# EAGLE design CrackberryPi_1.0.2 (EAGLE 6.5.0)
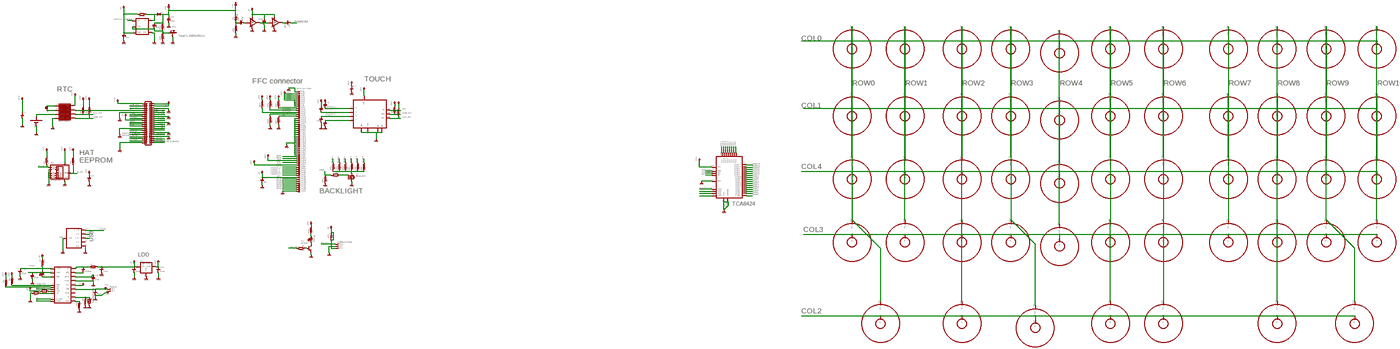
[diagram p0: schematic, sheet 1, overview]
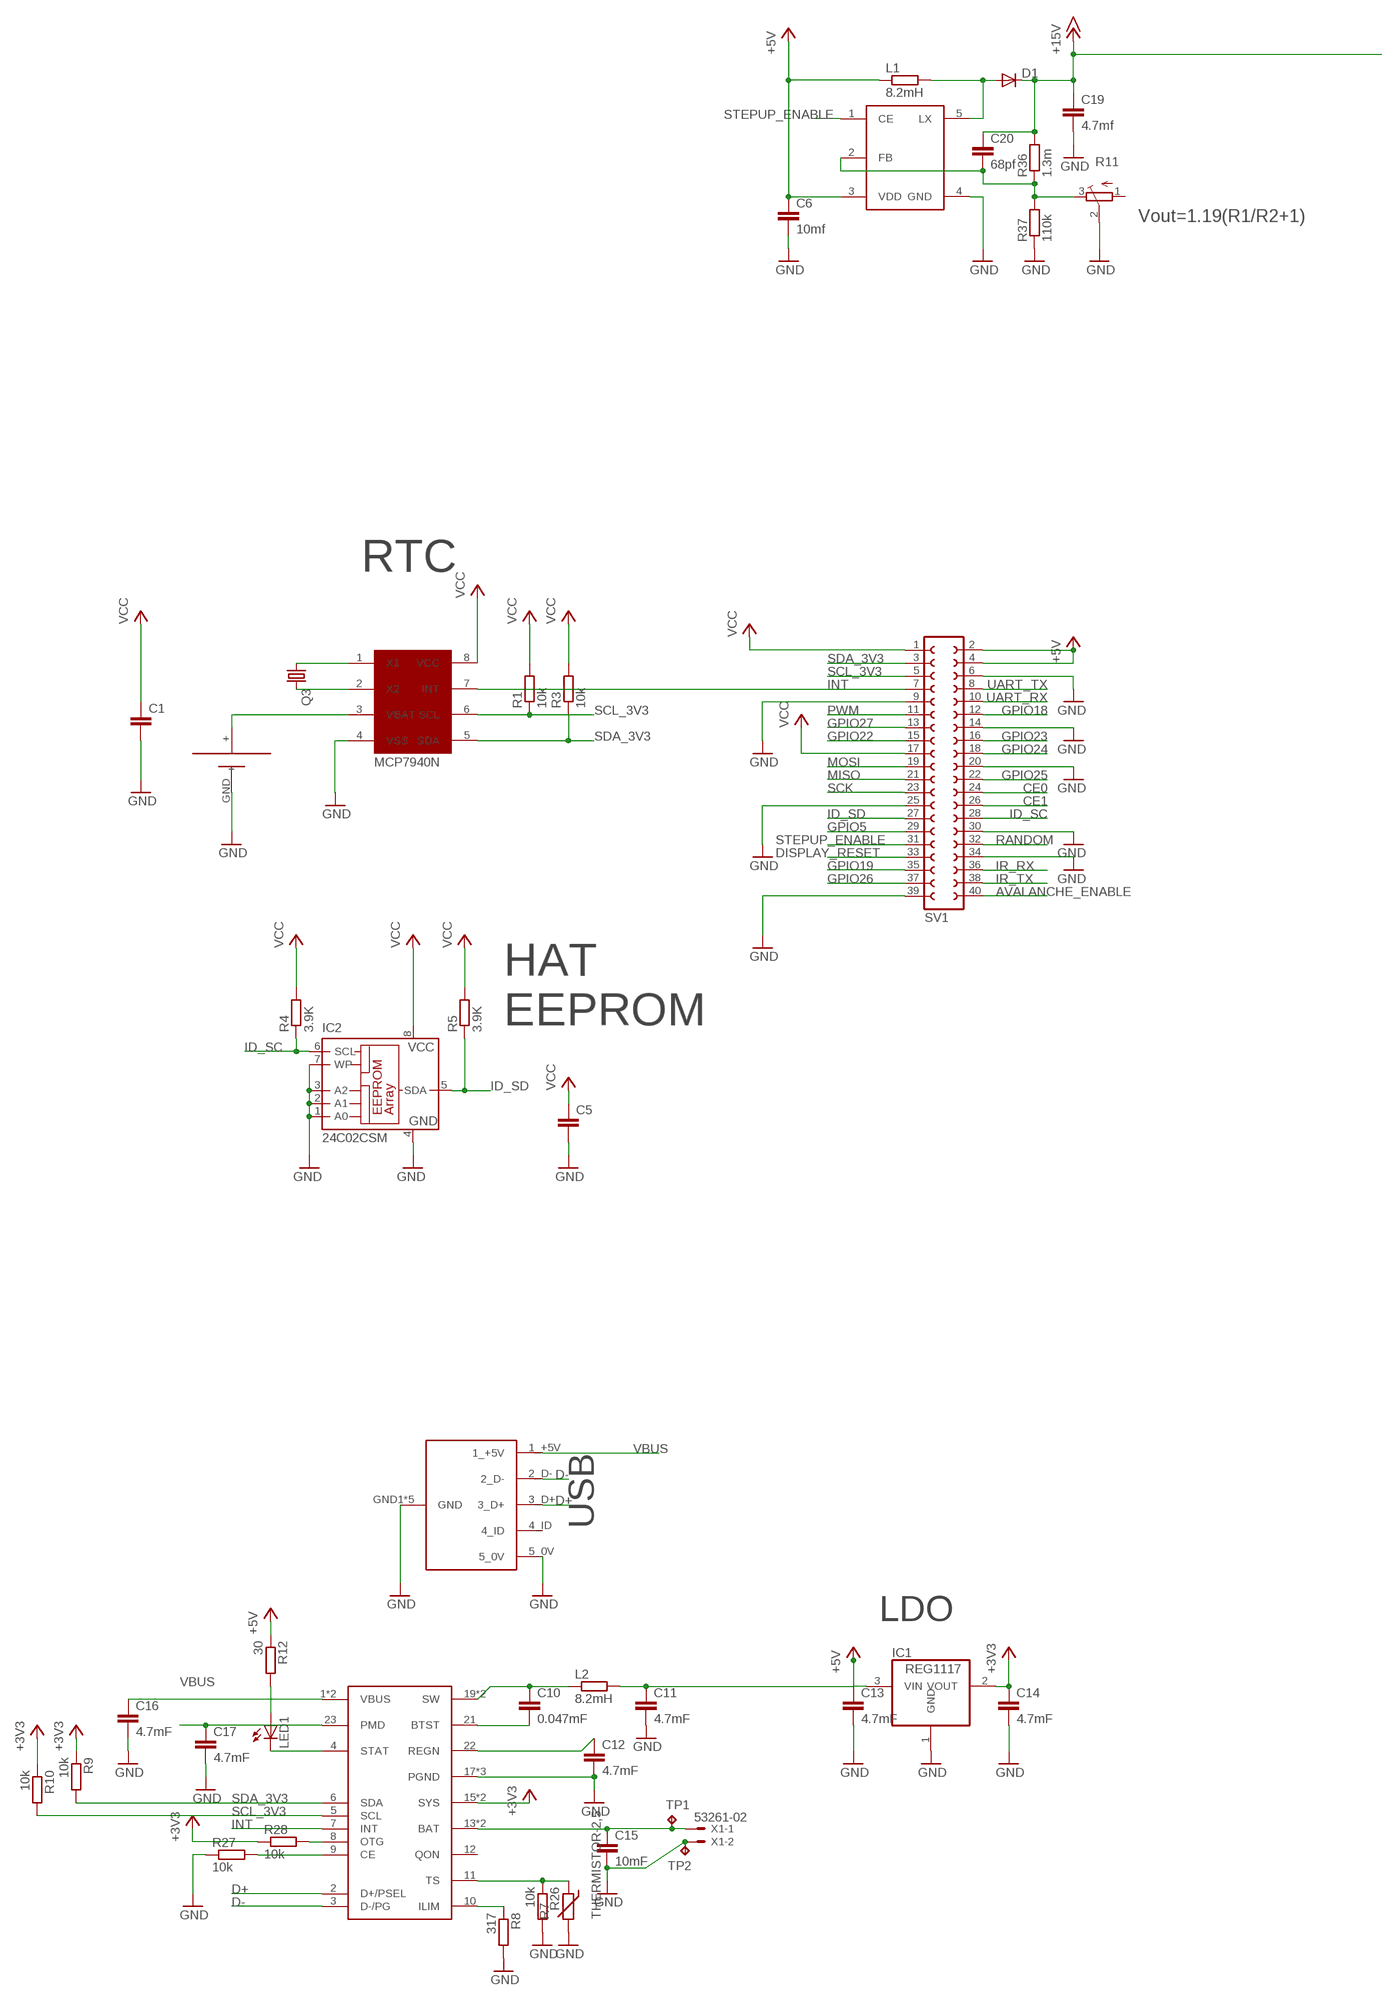
[diagram p1: schematic, sheet 1, part 1 of 4]
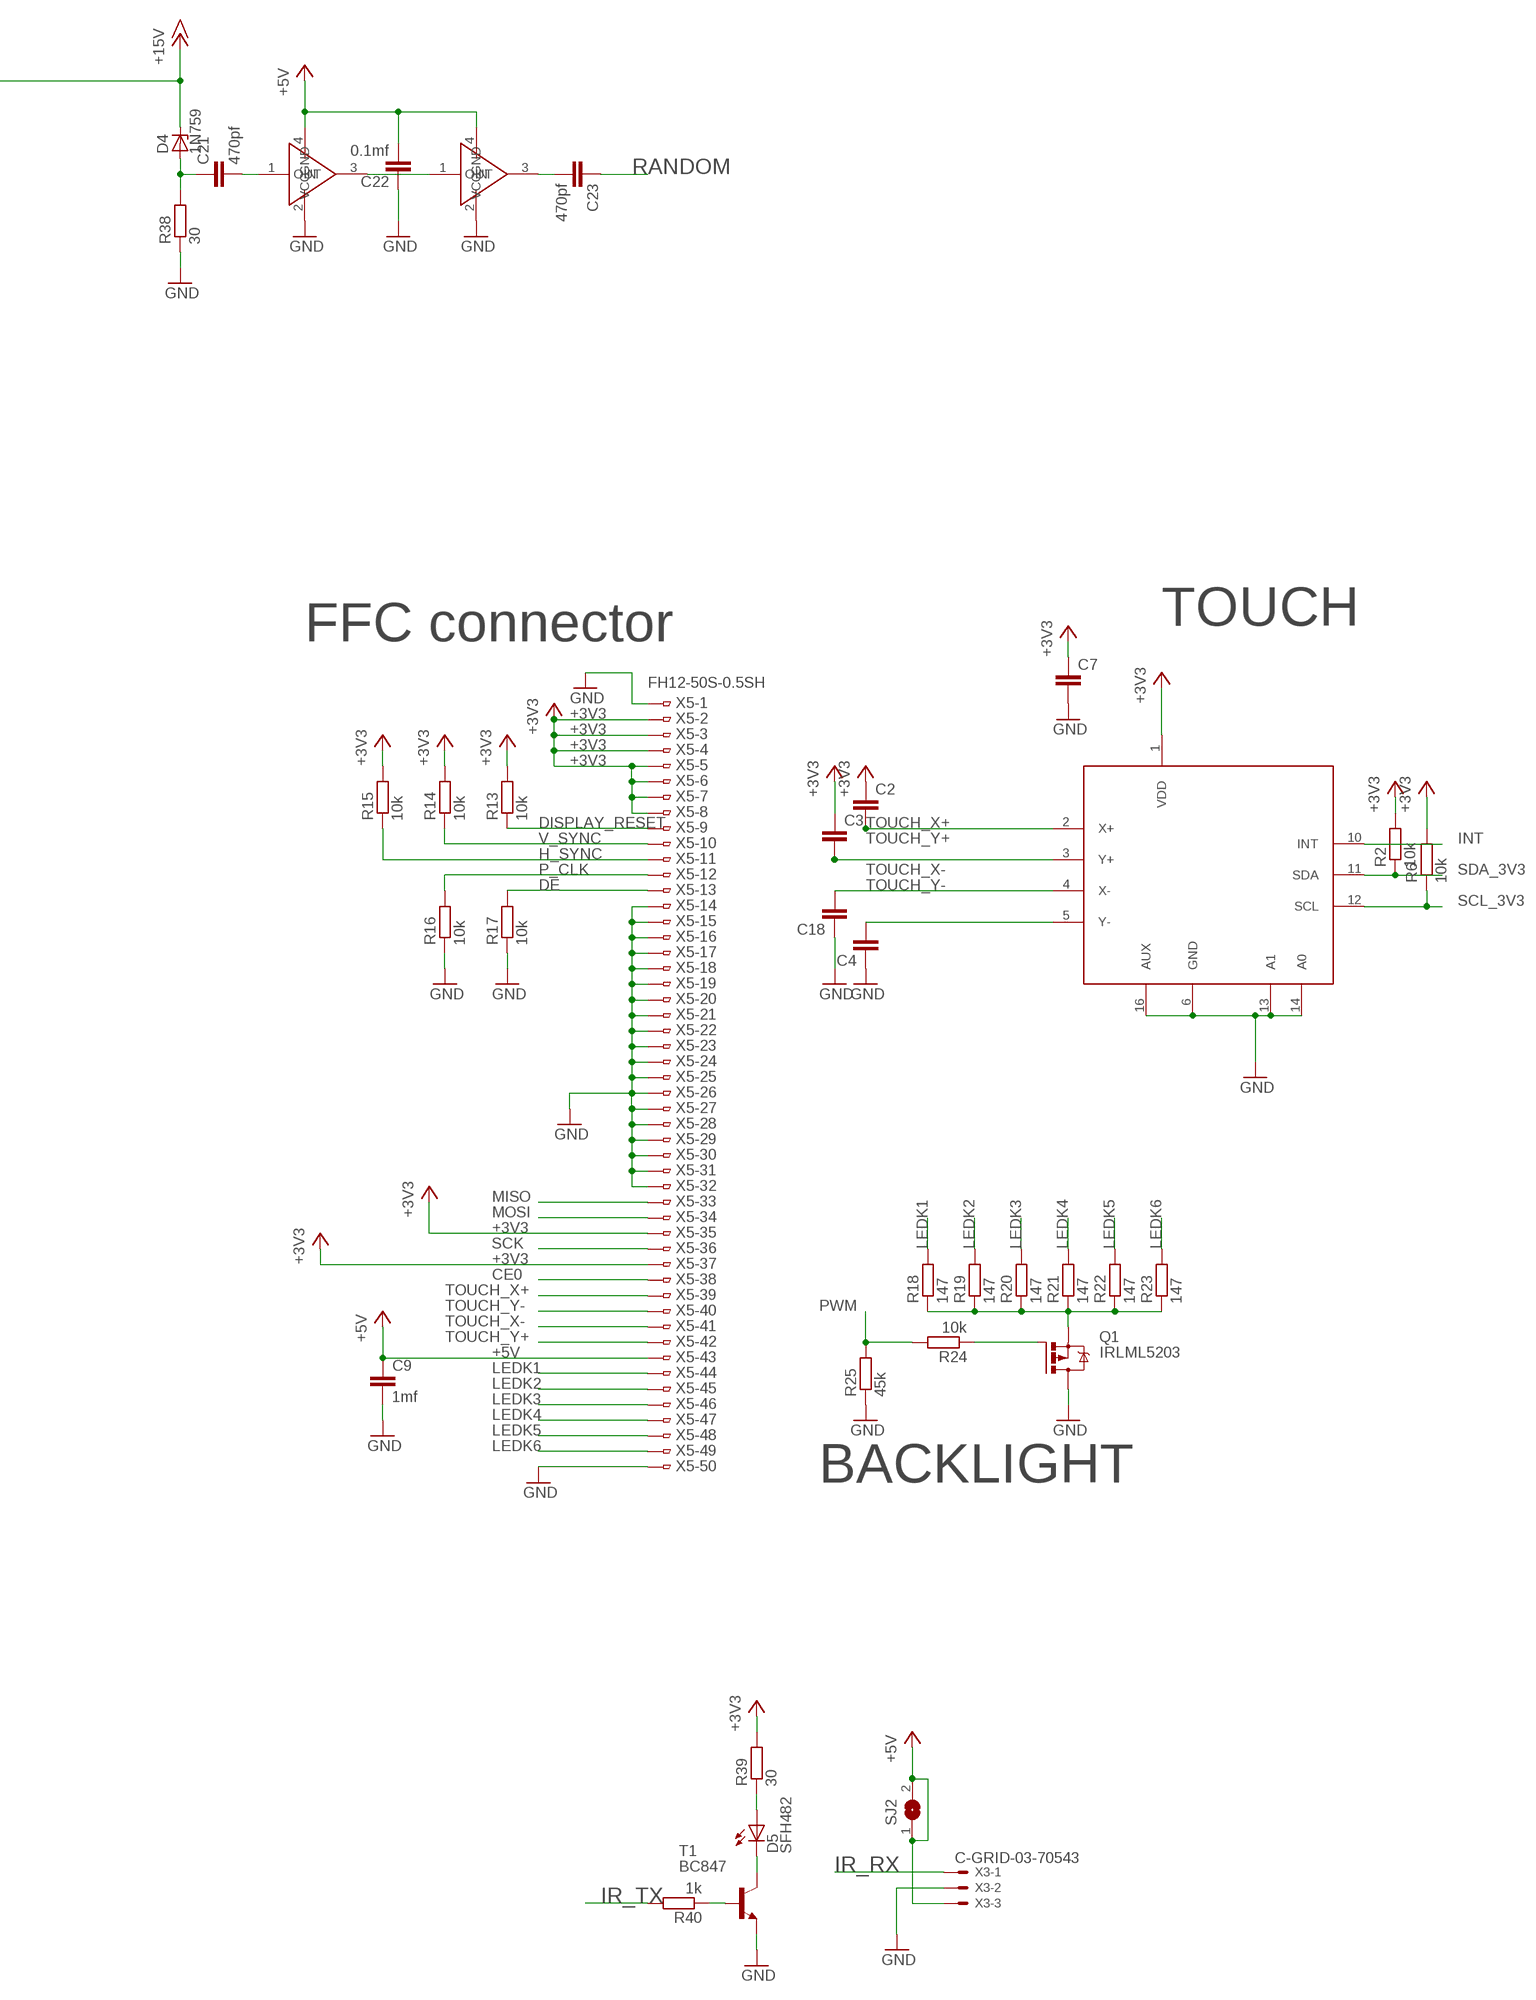
[diagram p2: schematic, sheet 1, part 2 of 4]
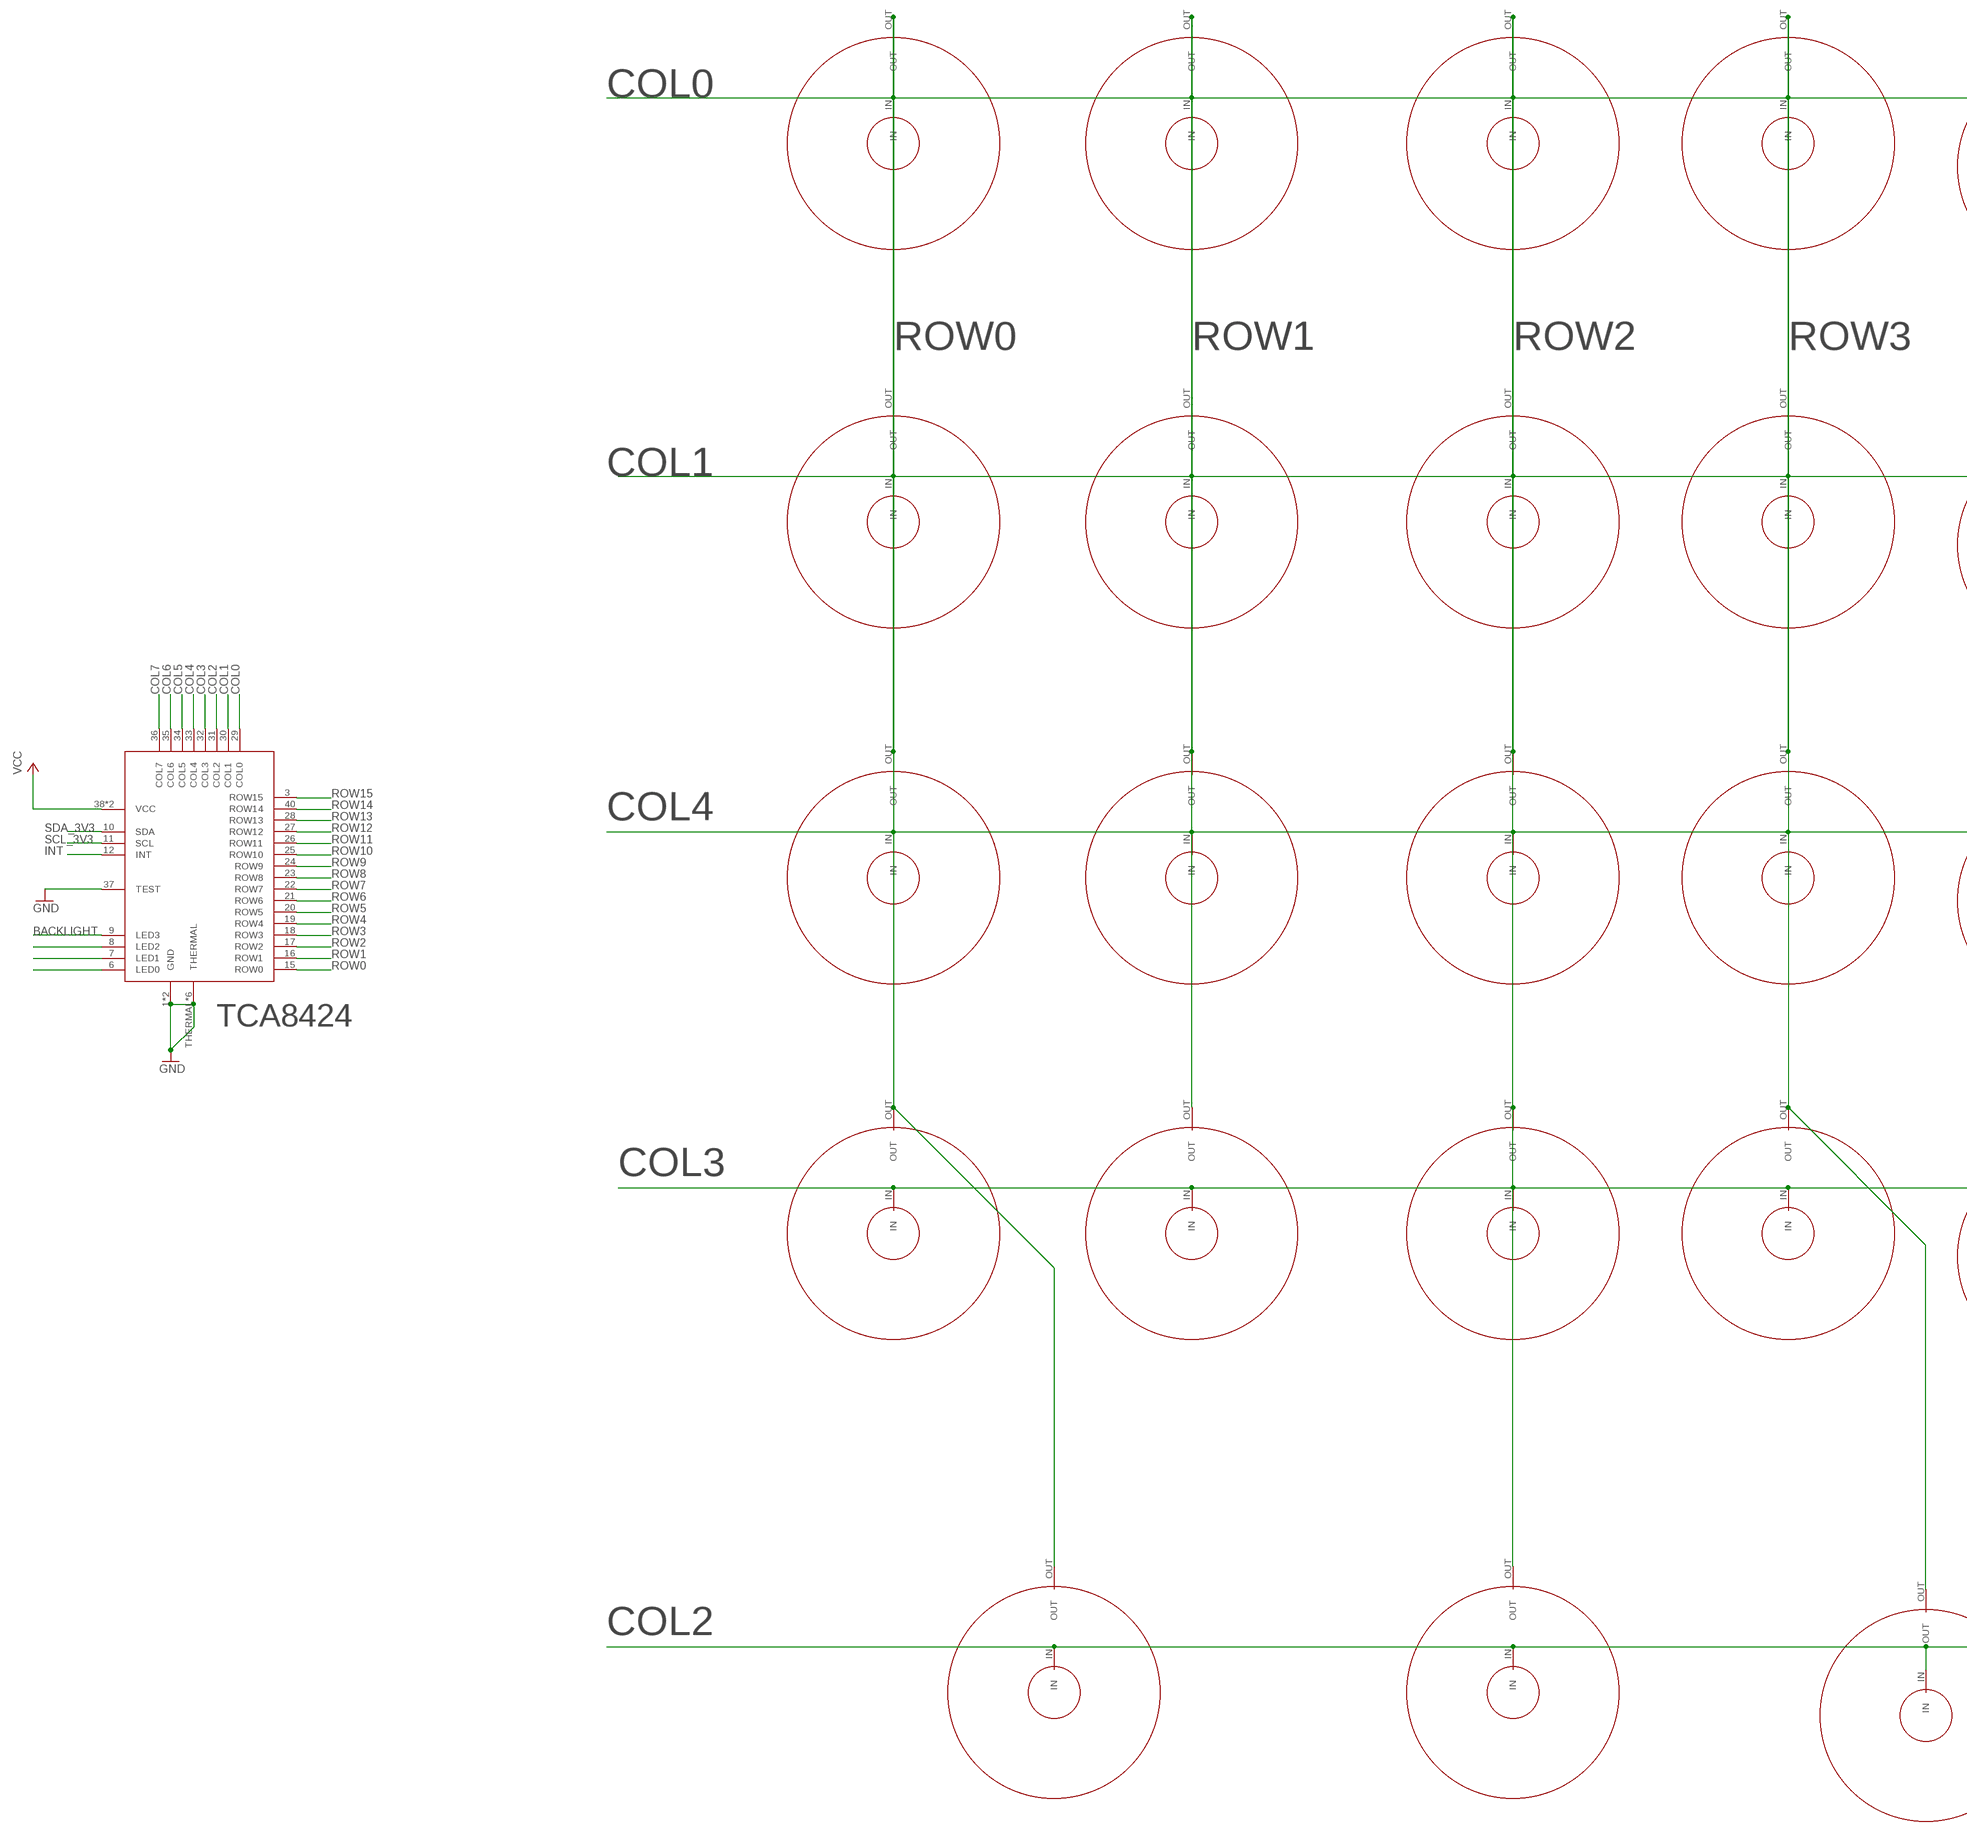
[diagram p3: schematic, sheet 1, part 3 of 4]
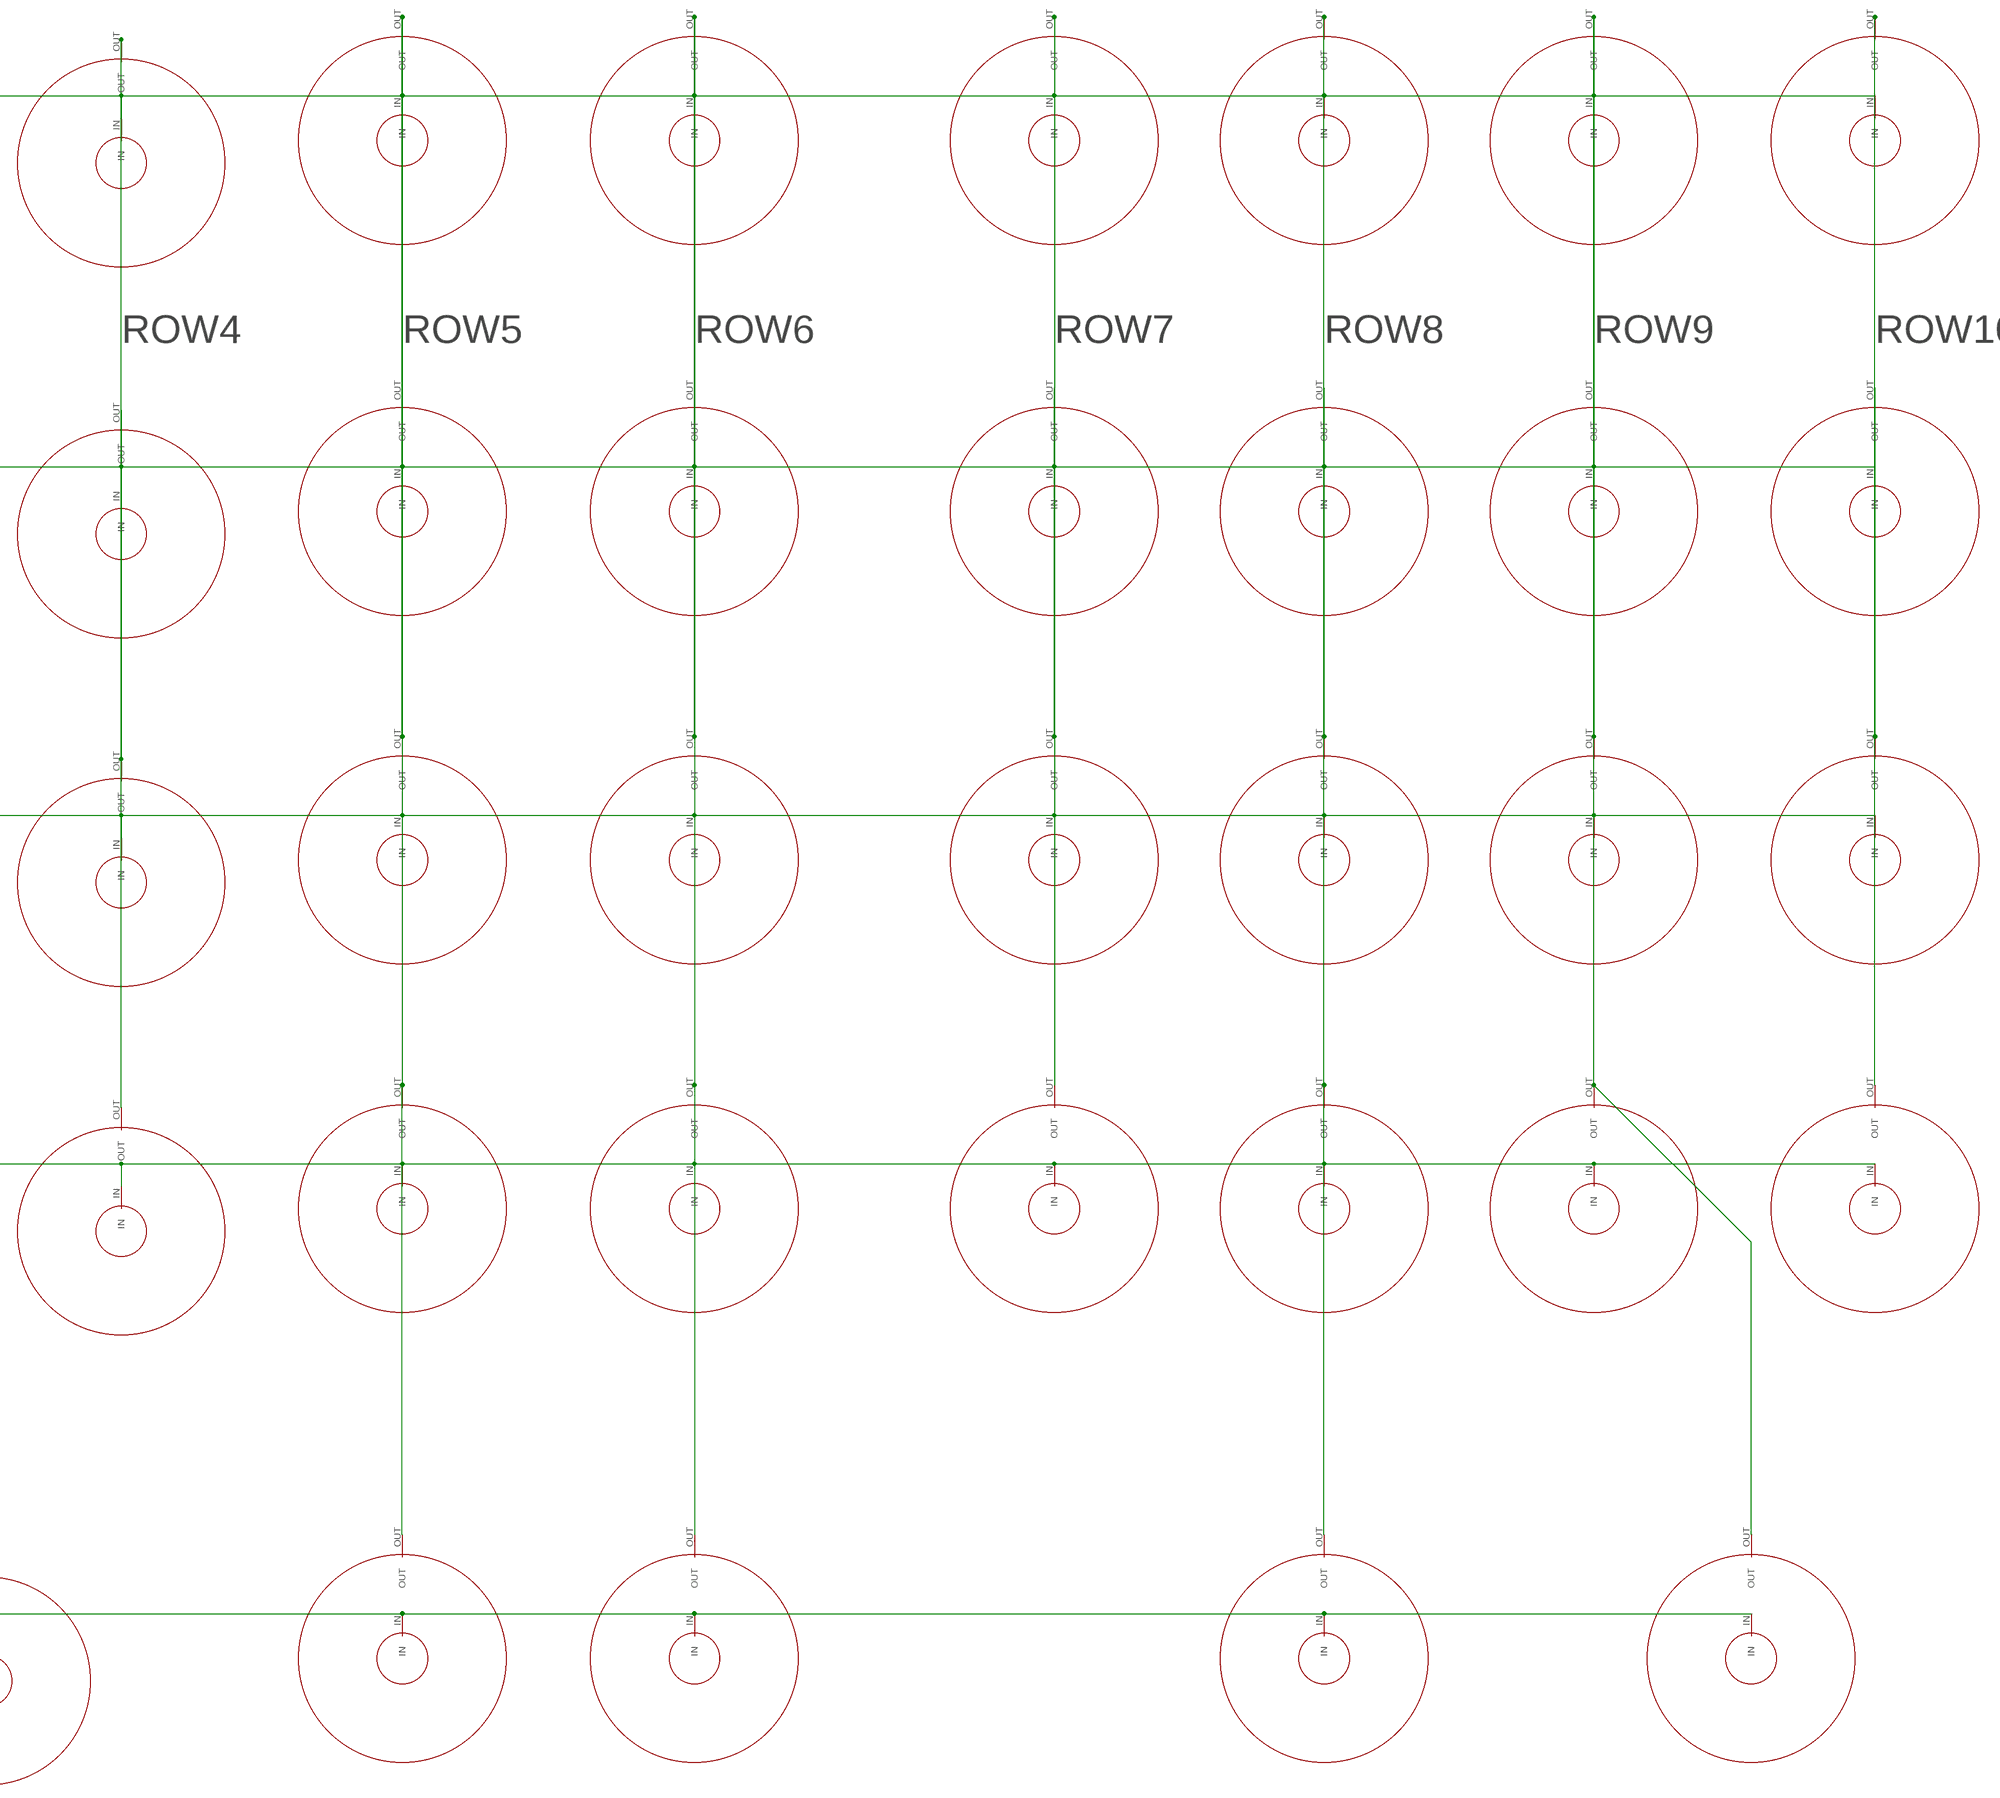
[diagram p4: schematic, sheet 1, part 4 of 4]

## Parts
0  DOME  [4MM]
1  DOME  [4MM]
2  DOME  [4MM]
3  DOME  [4MM]
4  DOME  [4MM]
5  DOME  [4MM]
6  DOME  [4MM]
7  DOME  [4MM]
8  DOME  [4MM]
9  DOME  [4MM]
!  DOME  [4MM]
(  DOME  [4MM]
)  DOME  [4MM]
+  DOME  [4MM]
,  DOME  [4MM]
-  DOME  [4MM]
.  DOME  [4MM]
?  DOME  [4MM]
@  DOME  [4MM]
A  DOME  [4MM]
B  DOME  [4MM]
C  DOME  [4MM]
C1  C-EUC0603  [C0603]
C2  C-EUC0603  [C0603]
C3  C-EUC0603  [C0603]
C4  C-EUC0603  [C0603]
C5  C-EUC0603  [C0603]
C6  10mf  C-EUC0603  [C0603]
C7  C-EUC0603  [C0603]
C9  1mf  C-EUC0603  [C0603]
C10  0.047mF  C-EUC0603  [C0603]
C11  4.7mF  C-EUC0603  [C0603]
C12  4.7mF  C-EUC0603  [C0603]
C13  4.7mF  C-EUC0603  [C0603]
C14  4.7mF  C-EUC0603  [C0603]
C15  10mF  C-EUC0603  [C0603]
C16  4.7mF  C-EUC0603  [C0603]
C17  4.7mF  C-EUC0603  [C0603]
C18  C-EUC0603  [C0603]
C19  4.7mf  C-EUC0603  [C0603]
C20  68pf  C-EUC0603  [C0603]
C21  470pf  C-EUC0603  [C0603]
C22  0.1mf  C-EUC0603  [C0603]
C23  470pf  C-EUC0603  [C0603]
D  DOME  [4MM]
D1  DIODE-SOD123  [SOD123]
D4  1N759  ZENER-DIODESOD80C  [SOD80C]
D5  SFH482  [SFH482]
E  DOME  [4MM]
F  DOME  [4MM]
FN-RIGHT  DOME  [4MM]
G  DOME  [4MM]
H  DOME  [4MM]
I  DOME  [4MM]
IC1  REG1117  [SOT223]
IC2  24C02CSM  [SO-08M]
J  DOME  [4MM]
K  DOME  [4MM]
L  DOME  [4MM]
L1  8.2mH  R-EU_R1206W  [R1206W]
L2  8.2mH  R-EU_R1206W  [R1206W]
LED1  LEDSML0603  [SML0603]
M  DOME  [4MM]
N  DOME  [4MM]
O  DOME  [4MM]
P  DOME  [4MM]
Q  DOME  [4MM]
Q1  IRLML5203  [MICRO3]
Q3  CRYSTALMM20SS  [MM20SS]
R  DOME  [4MM]
R1  10k  R-EU_R0603  [R0603]
R2  10k  R-EU_R0603  [R0603]
R3  10k  R-EU_R0603  [R0603]
R4  3.9K  R-EU_R0603  [R0603]
R5  3.9K  R-EU_R0603  [R0603]
R6  10k  R-EU_R0603  [R0603]
R7  THERMISTOR-2,5  [RS-2,5]
R8  317  R-EU_R0603  [R0603]
R9  10k  R-EU_R0603  [R0603]
R10  10k  R-EU_R0603  [R0603]
R11  TRIM_EU-3223G  [3223G]
R12  30  R-EU_R0603  [R0603]
R13  10k  R-EU_R0603  [R0603]
R14  10k  R-EU_R0603  [R0603]
R15  10k  R-EU_R0603  [R0603]
R16  10k  R-EU_R0603  [R0603]
R17  10k  R-EU_R0603  [R0603]
R18  147  R-EU_R0603  [R0603]
R19  147  R-EU_R0603  [R0603]
R20  147  R-EU_R0603  [R0603]
R21  147  R-EU_R0603  [R0603]
R22  147  R-EU_R0603  [R0603]
R23  147  R-EU_R0603  [R0603]
R24  10k  R-EU_R0603  [R0603]
R25  45k  R-EU_R0603  [R0603]
R26  10k  R-EU_R0603  [R0603]
R27  10k  R-EU_R0603  [R0603]
R28  10k  R-EU_R0603  [R0603]
R36  1.3m  R-EU_R0603  [R0603]
R37  110k  R-EU_R0603  [R0603]
R38  30  R-EU_R0603  [R0603]
R39  30  R-EU_R0603  [R0603]
R40  1k  R-EU_R0603  [R0603]
S  DOME  [4MM]
SHIFT-RIGHT  DOME  [4MM]
SHILFT-LEFT  DOME  [4MM]
SJ2  SJ  [SJ]
SPACE1  DOME  [4MM]
SPACE2  DOME  [4MM]
SPACE3  DOME  [4MM]
SV1  FE20-2  [FE20-2]
T  DOME  [4MM]
T1  BC847  [SOT23]
TP1  TPTP20SQ  [TP20SQ]
TP2  TPTP20SQ  [TP20SQ]
U  DOME  [4MM]
U$1  BQ24297  [VQFN-4X4-24]
U$2  NCP1406  [SOT23-5L]
U$3  MAX2650  [SOT143-W]
U$4  CR1216  [CR1216]
U$5  MCP7940N  [SO08]
U$6  TSC2007  [TSSOP16]
U$7  TCA8424  [QFN40]
U$9  MICRO_USB  [MICRO_USB]
U$10  MAX2650  [SOT143-W]
V  DOME  [4MM]
W  DOME  [4MM]
X  DOME  [4MM]
X1  53261-02  [53261-02]
X3  C-GRID-03-70543  [70543-03]
X5  FH12-50S-0.5SH  [FH12-50S-0.5SH]
Y  DOME  [4MM]
Z  DOME  [4MM]

## Nets
+3V3: C2.1 C3.1 C7.1 C14.1 IC1.2(VOUT) R2.2 R6.2 R9.1 R10.1 R13.2 R14.2 R15.2 R28.1 R39.2 U$1.15(SYS) U$1.16(SYS) U$6.1(VDD) X5.2 X5.3 X5.4 X5.5 X5.6 X5.7 X5.8 X5.35 X5.37
+5V: C6.1 C9.1 C11.1 C13.1 C22.2 IC1.3(VIN) L1.1 L2.2 R12.1 SJ2.1 SJ2.2 SV1.2 SV1.4 U$2.3(VDD) U$3.4(VCC) U$10.4(VCC) X3.3 X5.43
+15V: C19.1 C20.1 D1.C D4.C R36.2
AVALANCHE_ENABLE: SV1.40
BACKLIGHT: U$7.9(LED3)
BASE: R40.1 T1.1(B)
CE0: SV1.24 X5.38
CE1: SV1.26
COL0: 0.IN 1.IN 2.IN 3.IN 4.IN 5.IN 6.IN 7.IN 8.IN 9.IN -.IN U$7.29(COL0)
COL1: +.IN E.IN I.IN O.IN P.IN Q.IN R.IN T.IN U$7.30(COL1) U.IN W.IN Y.IN
COL2: @.IN FN-RIGHT.IN SHIFT-RIGHT.IN SHILFT-LEFT.IN SPACE1.IN SPACE2.IN SPACE3.IN U$7.31(COL2)
COL3: !.IN ,.IN ..IN ?.IN B.IN C.IN M.IN N.IN U$7.32(COL3) V.IN X.IN Z.IN
COL4: (.IN ).IN A.IN D.IN F.IN G.IN H.IN J.IN K.IN L.IN S.IN U$7.33(COL4)
COL5: U$7.34(COL5)
COL6: U$7.35(COL6)
COL7: U$7.36(COL7)
COLLECTOR: D5.K(C) T1.3(C)
D+: U$1.2(D+/PSEL) U$9.3_D+
D-: U$1.3(D-/PG) U$9.2_D-
DE: R17.2 X5.13
DISPLAY_RESET: R13.1 SV1.33 X5.9
EMITTER: T1.2(E) ; supply symbol labelled GND
FB: C20.2 R11.3(E) R36.1 R37.2 U$2.2(FB)
GND: C1.2 C4.1 C5.2 C6.2 C7.2 C9.2 C11.2 C12.2 C13.2 C14.2 C15.2 C16.2 C17.2 C18.1 C19.2 C22.1 IC1.1(GND) IC2.1(A0) IC2.2(A1) IC2.3(A2) IC2.4(GND) IC2.7(WP) Q1.3(D) R7.2 R8.2 R11.2(S) R16.1 R17.1 R25.1 R26.2 R27.1 R37.1 R38.1 SV1.6 SV1.9 SV1.14 SV1.20 SV1.25 SV1.30 SV1.34 SV1.39 TP2.TP U$1.17(PGND) U$1.18(PGND) U$1.P$1(PGND) U$2.4(GND) U$3.2(GND) U$4.GND(-) U$5.4(VSS) U$6.6(GND) U$6.13(A1) U$6.14(A0) U$6.16(AUX) U$7.1(GND) U$7.4(GND) U$7.37(TEST) U$7.THERMAL U$7.VIA1(THERMAL) U$7.VIA2(THERMAL) U$7.VIA3(THERMAL) U$7.VIA4(THERMAL) U$7.VIA5(THERMAL) U$9.5_0V U$9.GND1(GND) U$9.GND2(GND) U$9.GND5(GND) U$9.P$1(GND) U$9.P$7(GND) U$10.2(GND) X1.2 X3.2 X5.1 X5.14 X5.15 X5.16 X5.17 X5.18 X5.19 X5.20 X5.21 X5.22 X5.23 X5.24 X5.25 X5.26 X5.27 X5.28 X5.29 X5.30 X5.31 X5.32 X5.50
GPIO5: SV1.29
GPIO18: SV1.12
GPIO19: SV1.35
GPIO22: SV1.15
GPIO23: SV1.16
GPIO24: SV1.18
GPIO25: SV1.22
GPIO26: SV1.37
GPIO27: SV1.13
H_SYNC: R15.1 X5.11
ID_SC: IC2.6(SCL) R4.1 SV1.28
ID_SD: IC2.5(SDA) R5.1 SV1.27
IN_1: C21.2 U$3.1(IN)
INT: SV1.7 U$1.7(INT) U$5.7(INT) U$6.10(INT) U$7.12(INT)
IR_RX: SV1.36 X3.1
IR_TX: R40.2 SV1.38
LEDK1: R18.2 X5.44
LEDK2: R19.2 X5.45
LEDK3: R20.2 X5.46
LEDK4: R21.2 X5.47
LEDK5: R22.2 X5.48
LEDK6: R23.2 X5.49
LX: D1.A L1.2 U$2.5(LX)
MISO: SV1.21 X5.33
MOSI: SV1.19 X5.34
N$1: C10.1 L2.1 U$1.19(SW) U$1.20(SW)
N$2: C10.2 U$1.21(BTST)
N$3: C15.1 TP1.TP U$1.13(BAT) U$1.14(BAT) X1.1
N$4: LED1.A R12.2
N$5: C12.1 U$1.22(REGN)
N$6: R7.1 R26.1 U$1.11(TS)
N$7: R8.1 U$1.10(ILIM)
N$8: C17.1 U$1.23(PMD)
N$9: LED1.C U$1.4(STAT)
N$10: U$7.6(LED0)
N$11: Q3.1 U$5.1(X1)
N$12: Q1.2(S) R18.1 R19.1 R20.1 R21.1 R22.1 R23.1
N$13: Q3.4 U$5.2(X2)
N$14: U$7.7(LED1)
N$15: R27.2 U$1.9(CE)
N$16: C21.1 D4.A R38.2
N$17: R28.2 U$1.8(OTG)
N$18: U$7.8(LED2)
N$20: Q1.1(G) R24.1
N$30: D5.A R39.1
OUT1_IN2: U$3.3(OUT) U$10.1(IN)
OUT2: C23.2 U$10.3(OUT)
P_CLK: R16.2 X5.12
PWM: R24.2 R25.2 SV1.11
RANDOM: C23.1 SV1.32
ROW0: 1.OUT A.OUT Q.OUT SHILFT-LEFT.OUT U$7.15(ROW0) Z.OUT
ROW1: 2.OUT S.OUT U$7.16(ROW1) W.OUT X.OUT
ROW2: 3.OUT C.OUT D.OUT E.OUT SPACE1.OUT U$7.17(ROW2)
ROW3: 4.OUT F.OUT R.OUT SPACE2.OUT U$7.18(ROW3) V.OUT
ROW4: 5.OUT B.OUT G.OUT T.OUT U$7.19(ROW4)
ROW5: 6.OUT H.OUT N.OUT SPACE3.OUT U$7.20(ROW5) Y.OUT
ROW6: 7.OUT J.OUT M.OUT SHIFT-RIGHT.OUT U$7.21(ROW6) U.OUT
ROW7: 8.OUT ?.OUT I.OUT K.OUT U$7.22(ROW7)
ROW8: 9.OUT !.OUT @.OUT L.OUT O.OUT U$7.23(ROW8)
ROW9: 0.OUT (.OUT ,.OUT FN-RIGHT.OUT P.OUT U$7.24(ROW9)
ROW10: ).OUT +.OUT -.OUT ..OUT U$7.25(ROW10)
ROW11: U$7.26(ROW11)
ROW12: U$7.27(ROW12)
ROW13: U$7.28(ROW13)
ROW14: U$7.40(ROW14)
ROW15: U$7.3(ROW15)
SCK: SV1.23 X5.36
SCL_3V3: R1.1 R6.1 R10.2 SV1.5 U$1.5(SCL) U$5.6(SCL) U$6.12(SCL) U$7.11(SCL)
SDA_3V3: R2.1 R3.1 R9.2 SV1.3 U$1.6(SDA) U$5.5(SDA) U$6.11(SDA) U$7.10(SDA)
STEPUP_ENABLE: SV1.31 U$2.1(CE)
TOUCH_X+: C2.2 U$6.2(X+) X5.39
TOUCH_X-: C18.2 U$6.4(X-) X5.41
TOUCH_Y+: C3.2 U$6.3(Y+) X5.42
TOUCH_Y-: C4.2 U$6.5(Y-) X5.40
UART_RX: SV1.10
UART_TX: SV1.8
V_SYNC: R14.1 X5.10
VBAT+: U$4.+ U$5.3(VBAT)
VBUS: C16.1 U$1.1(VBUS) U$1.24(VBUS) U$9.1_+5V
VCC: C1.1 C5.1 IC2.8(VCC) R1.2 R3.2 R4.2 R5.2 SV1.1 SV1.17 U$5.8(VCC) U$7.38(VCC) U$7.39(VCC)
Unconnected: R11.1(A) U$1.12(QON) U$9.4_ID

## Notes on the sheet
- Vout=1.19(R1/R2+1)
- FFC connector | TOUCH
- RTC
- MCP7940N
- HAT
  EEPROM
- BACKLIGHT
- TCA8424
- USB
- LDO

## Library data of the parts
0 1-9 ! ( ) + , - . ? @ A B C D E F FN-RIGHT G H I J K L M N O P Q R S SHIFT-RIGHT SHILFT-LEFT SPACE1-SPACE3 T U V W X Y Z = DOME:DOME
C1-C7 C9-C23 = rcl:C-EU: CAPACITOR, European symbol
D1 = diode:DIODE-: DIODE
D4 = diode:ZENER-DIODE: Z-Diode
D5 = led:SFH482: IR LED infrared emitting diode, Infineon
IC1 = burr-brown:REG1117: 800mA and 1A Low Dropout (LDO) Positive Regulator 1.8V, 2.5V, 2.85V, 3.3V, 5V, and Adj; MPN: REG1117; OC_FARNELL: 1097566; OC_NEWARK: 14P6981
IC2 = microchip:24C*: Serial EEPROM 1 K/2 K/4 K; MF: MICROCHIP; MPN: 24C02C-I/SN; OC_FARNELL: 1084339; OC_NEWARK: 96K4063
L1 L2 R1-R6 R8-R10 R12-R28 R36-R40 = rcl:R-EU_: RESISTOR, European symbol
LED1 = led:LED: LED OSRAM: - CHIPLED LG R971, LG N971, LY N971, LG Q971, LY Q971, LO R971, LY R971 LH N974, LH R974 LS Q976, LO Q976, LY Q976 LO Q996 - Hyper CHIPLED LW Q18S LB Q993, LB Q99A, LB R99A - SideLED LS A670, LO A670, LY A670, LG A670, LP A670 LB A673, LV A673, LT A673, LW A673 LH A674 LY A675 LS A676, LA A676, LO A676, LY A676, LW A676 LS A679, LY A679, LG A679 - Hyper Micro SIDELED® LS Y876, LA Y876, LO Y876, LY Y876 LT Y87S - SmartLED LW L88C, LW L88S LB L89C, LB L89S, LG L890 LS L89K, LO L89K, LY L89K LS L896, LA L896, LO L896, LY L896 - TOPLED LS T670, LO T670, LY T670, LG T670, LP T670 LSG T670, LSP T670, LSY T670, LOP T670, LYG T670 LG T671, LOG T671, LSG T671 LB T673, LV T673, LT T673, LW T673 LH T674 LS T676, LA T676, LO T676, LY T676, LB T676, LH T676, LSB T676, LW T676 LB T67C, LV T67C, LT T67C, LS T67K, LO T67K, LY T67K, LW E67C LS E67B, LA E67B, LO E67B, LY E67B, LB E67C, LV E67C, LT E67C LW T67C LS T679, LY T679, LG T679 LS T770, LO T770, LY T770, LG T770, LP T770 LB T773, LV T773, LT T773, LW T773 LH T774 LS E675, LA E675, LY E675, LS T675 LS T776, LA T776, LO T776, LY T776, LB T776 LHGB T686 LT T68C, LB T68C - Hyper Mini TOPLED® LB M676 - Mini TOPLED Santana® LG M470 LS M47K, LO M47K, LY M47K Source: http://www.osram.convergy.de LUXEON: - LUMILED® LXK2-PW12-R00, LXK2-PW12-S00, LXK2-PW14-U00, LXK2-PW14-V00 LXK2-PM12-R00, LXK2-PM12-S00, LXK2-PM14-U00 LXK2-PE12-Q00, LXK2-PE12-R00, LXK2-PE12-S00, LXK2-PE14-T00, LXK2-PE14-U00 LXK2-PB12-K00, LXK2-PB12-L00, LXK2-PB12-M00, LXK2-PB14-N00, LXK2-PB14-P00, LXK2-PB14-Q00 LXK2-PR12-L00, LXK2-PR12-M00, LXK2-PR14-Q00, LXK2-PR14-R00 LXK2-PD12-Q00, LXK2-PD12-R00, LXK2-PD12-S00 LXK2-PH12-R00, LXK2-PH12-S00 LXK2-PL12-P00, LXK2-PL12-Q00, LXK2-PL12-R00 Source: www.luxeon.com KINGBRIGHT: KA-3528ASYC Source: www.kingbright.com
Q1 = transistor-power:IRLML5203: HEXFET P-Channel Power MOSFET
Q3 = crystal:CRYSTAL: CRYSTAL; OC_FARNELL: unknown; OC_NEWARK: unknown
R7 = varistor:THERMISTOR: THERMISTOR
R11 = pot:TRIM_EU-: POTENTIOMETER
SJ2 = jumper:SJ: SMD solder JUMPER
SV1 = con-lsta:FE20-2: FEMALE HEADER; OC_FARNELL: unknown; OC_NEWARK: unknown
T1 = transistor:BC847: NPN TRANSISTOR
TP1 TP2 = testpad:TP: Test pad
U$1 = BQ24297:BQ24297
U$2 = ncp1406:NCP1406
U$3 U$10 = max2650:MAX2650
U$4 = cr1216:CR1216
U$5 = MCP7940N:MCP7940N
U$6 = tsc2046:TSC2007
U$7 = TCA8424:TCA8424
U$9 = MICRO_USB:MICRO_USB
X1 = con-molex:53?-02: CONNECTOR wire to board 1.25 mm (.049 inch) pitch header; OC_FARNELL: 1125373; OC_NEWARK: unknown
X3 = con-molex:C-GRID-03: CONNECTOR wire to board 2.54 mm (0.100") pitch header; OC_FARNELL: unknown; OC_NEWARK: unknown
X5 = FCI_62684:FH12-50S-0.5S: 0.5mm Pitch Connectors For FPC/FFC Source: Data sheet <http://www.hirose.co.jp/cataloge_hp/e58605370.pdf>; MPN: FH12-50S-0.5SH(55); OC_FARNELL: 1324557; OC_NEWARK: 34M6181

## Board
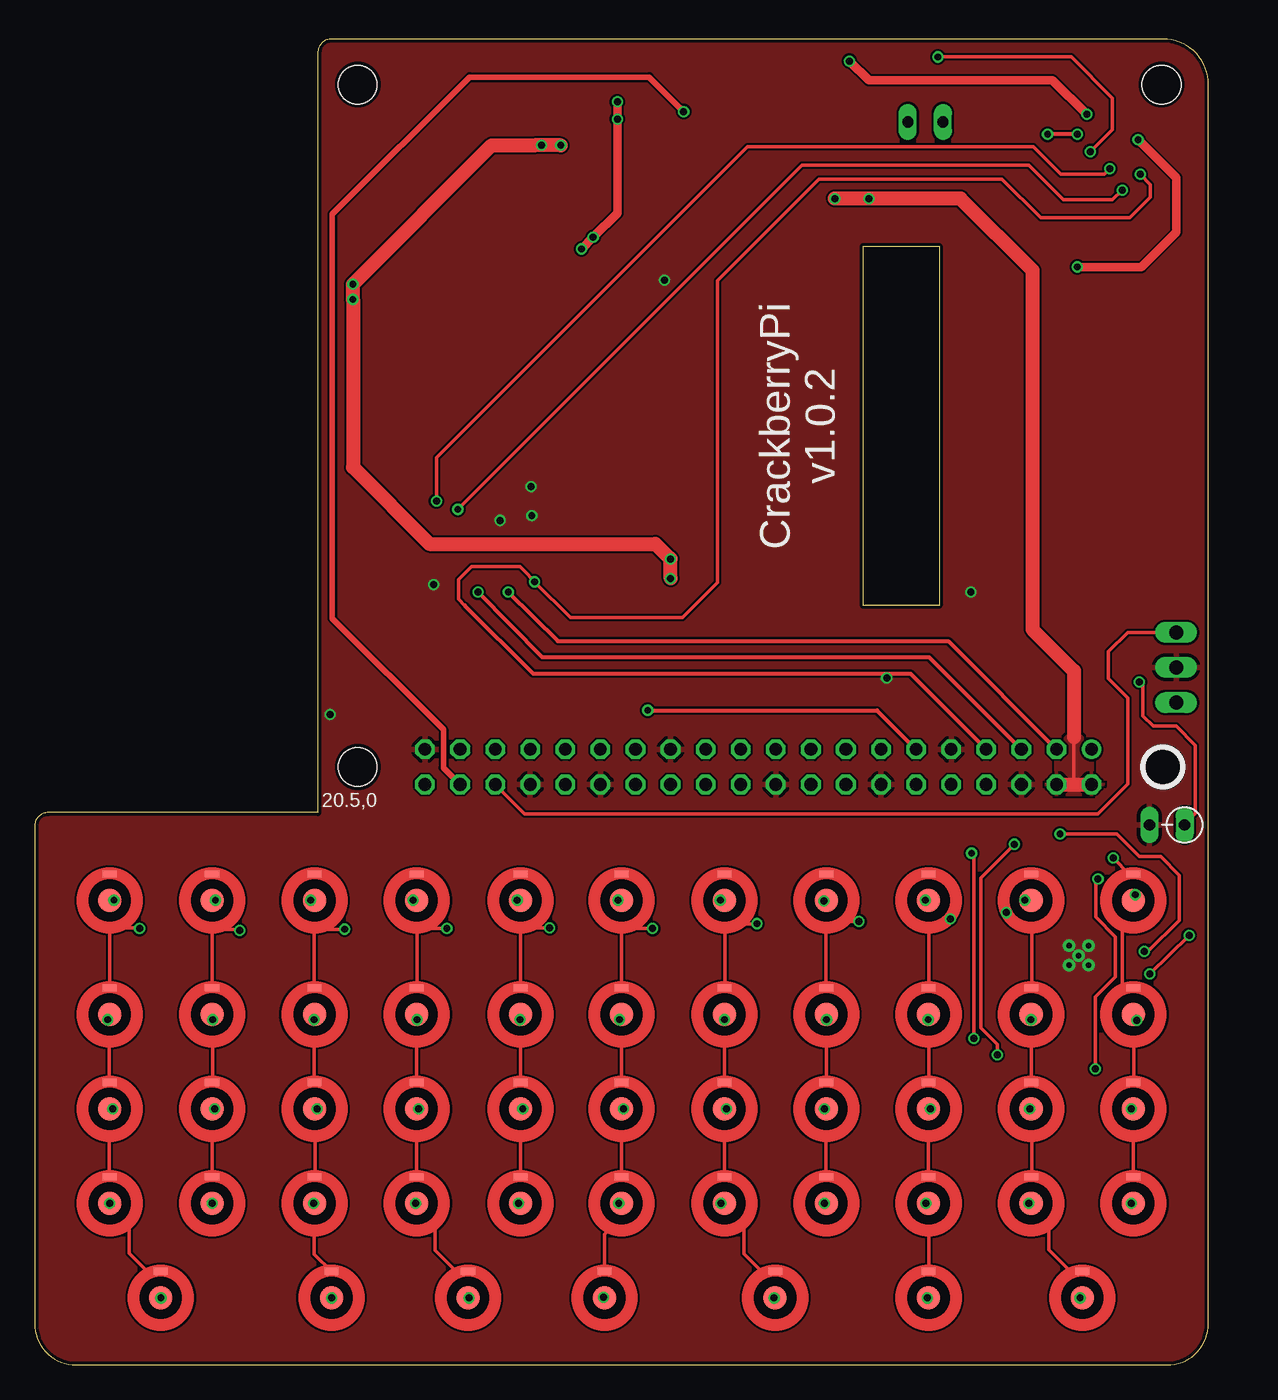
[diagram p5: board, top side]
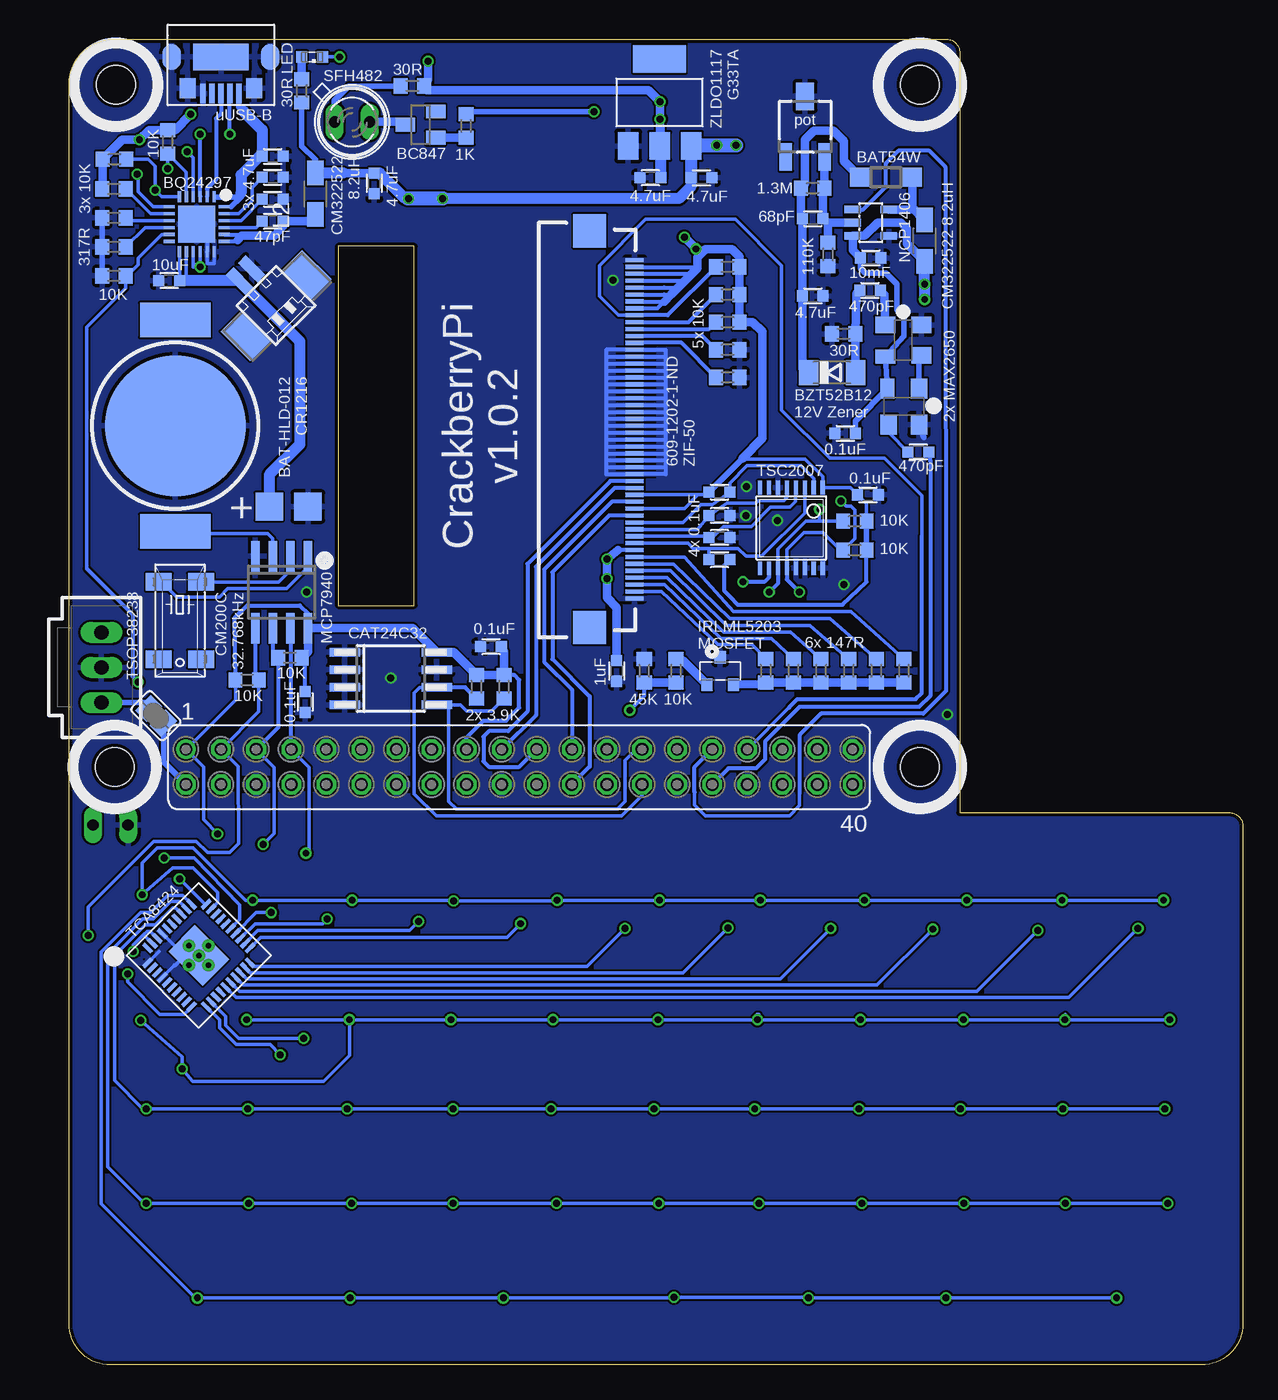
[diagram p6: board, bottom side, seen from below]

Size 85 x 96 mm. Coordinates in mm from the lower left corner, seen from the top.
Outline: 0,39 0,3 arc90 3,0 82,0 arc90 85,3 85,92.7 arc90 81.7,96 21.5,96 arc90 20.5,95 20.5,40 1,40 arc90 0,39
Outline: 65.5,55 60,55 60,81 65.5,81 65.5,55
Copper layers (1*16): Top 0.035mm / dielectric 1.5mm / Bottom 0.035mm
Design rules "SeeedStudio_2layer_DRU_no_angle_20140221": minimum track width 6mil, minimum drill 12mil, track to track 6mil, track to pad 6mil, pad to pad 6mil, via to via 6mil, smd to smd 0mil, copper to edge 10mil, drill to drill 10mil, minimum pad ring 10mil, minimum via ring 6mil, stop-mask expansion 2mil, vias tented up to drill 100mil, thermal gap 10mil
Holes 2.8 mm at 81.7,43.3 81.6,92.7 23.4,92.7 23.4,43.3
bKeepout: area 31.9,57 to 32.1,58.2
bRestrict: area 42.5,73.2 to 45.4,73.3; area 42.5,72.7 to 45.4,72.8; area 42.5,72.2 to 45.4,72.3; area 42.5,71.7 to 45.4,71.8; area 42.5,71.2 to 45.4,71.3; area 42.5,70.7 to 45.4,70.8; area 42.5,70.2 to 45.4,70.3; area 42.5,69.7 to 45.4,69.8; area 42.5,69.2 to 45.4,69.3; area 42.5,68.7 to 45.4,68.8; area 42.5,68.2 to 45.4,68.3; area 42.5,67.7 to 45.4,67.8; 10 more areas

### Footprints (pad centres in the part's own frame; a part is rotated, then mirrored left to right if it is on the bottom)
4MM = smd 1.7 x 1.7: IN 0,0 | smd 1 x 0.5: OUT 0,1.9
C0603 = smd 0.8 x 0.8: 1 -0.75,0; 2 0.75,0
SOD123 = smd 1.4 x 1.4: A 1.9,0; C -1.9,0
SOD80C = smd 1.4 x 1.8: A 1.7,0; C -1.7,0
SFH482 = drill 0.813 long: A -1.27,0; K 1.27,0
SOT223 = smd 1.499 x 2.007: 1 -2.261,-3.15; 2 0.025,-3.15; 3 2.311,-3.15 | smd 3.81 x 2.007: 4 0,3.15
SO-08M = smd 0.6 x 2.2: 1 -1.905,-3.33; 2 -0.635,-3.33; 3 0.635,-3.33; 4 1.905,-3.33; 5 1.905,3.33; 6 0.635,3.33; 7 -0.635,3.33; 8 -1.905,3.33
R1206W = smd 1.8 x 1.2: 1 -1.499,0; 2 1.499,0
SML0603 = smd 0.8 x 0.8: A 0.75,0; C -0.75,0
MICRO3 = smd 0.8 x 0.9: 1 -0.95,-1; 2 0.95,-1; 3 0,1
MM20SS = smd 1.27 x 1.88: 1 -2.794,-1.524; 2 2.794,-1.524; 3 2.794,1.524; 4 -2.794,1.524
R0603 = smd 1 x 1.1: 1 -0.85,0; 2 0.85,0
RS-2,5 = drill 0.813 long: 1 -1.27,0; 2 1.27,0
3223G = smd 2 x 0.9: 1 -2.2,1.4; 3 -2.2,-1.4 | smd 2 x 1.3: 2 2.2,0
SJ = smd 1.168 x 1.6: 1 -0.762,0; 2 0.762,0
FE20-2 = drill 0.914: 1 -24.13,1.27 | drill 0.914 octagon: 2 -24.13,-1.27; 3 -21.59,1.27; 4 -21.59,-1.27; 5 -19.05,1.27; 6 -19.05,-1.27; 7 -16.51,1.27; 8 -16.51,-1.27; 9 -13.97,1.27; 10 -13.97,-1.27; 11 -11.43,1.27; 12 -11.43,-1.27; 13 -8.89,1.27; 14 -8.89,-1.27; 15 -6.35,1.27; 16 -6.35,-1.27; 17 -3.81,1.27; 18 -3.81,-1.27; 19 -1.27,1.27; 20 -1.27,-1.27; 21 1.27,1.27; 22 1.27,-1.27; 23 3.81,1.27; 24 3.81,-1.27; 25 6.35,1.27; 26 6.35,-1.27; 27 8.89,1.27; 28 8.89,-1.27; 29 11.43,1.27; 30 11.43,-1.27; 31 13.97,1.27; 32 13.97,-1.27; 33 16.51,1.27; 34 16.51,-1.27; 35 19.05,1.27; 36 19.05,-1.27; 37 21.59,1.27; 38 21.59,-1.27; 39 24.13,1.27; 40 24.13,-1.27
SOT23 = smd 1 x 1.4: 1 -0.95,-1.1; 2 0.95,-1.1; 3 0,1.1
TP20SQ = smd 2 x 2: TP 0,0
VQFN-4X4-24 = smd 0.8 x 0.23: 1 -2,1.25; 2 -2,0.75; 3 -2,0.25; 4 -2,-0.25; 5 -2,-0.75; 6 -2,-1.25; 13 2,-1.25; 14 2,-0.75; 15 2,-0.25; 16 2,0.25; 17 2,0.75; 18 2,1.25 | smd 0.23 x 0.8: 7 -1.25,-2; 8 -0.75,-2; 9 -0.25,-2; 10 0.25,-2; 11 0.75,-2; 12 1.25,-2; 19 1.25,2; 20 0.75,2; 21 0.25,2; 22 -0.25,2; 23 -0.75,2; 24 -1.25,2 | smd 2.7 x 2.7: P$1 0,0
SOT23-5L = smd 0.55 x 1.2: 1 -0.95,-1.3; 2 0,-1.3; 3 0.95,-1.3; 4 0.95,1.3; 5 -0.95,1.3
SOT143-W = smd 1.2 x 1.45: 1 -1.1,-1.3; 2 -1.1,1.3; 3 1.1,1.3 | smd 1 x 1.45: 4 1.2,-1.3
CR1216 = smd 2.5 x 5.1: + -7.65,0; P$2 7.65,0 | smd 10.2 x 10.2: GND 0,0
SO08 = smd 0.6 x 2.2: 1 -1.905,-2.6; 2 -0.635,-2.6; 3 0.635,-2.6; 4 1.905,-2.6; 5 1.905,2.6; 6 0.635,2.6; 7 -0.635,2.6; 8 -1.905,2.6
TSSOP16 = smd 0.305 x 0.991: 1 -2.275,-2.918; 2 -1.625,-2.918; 3 -0.975,-2.918; 4 -0.325,-2.918; 5 0.325,-2.918; 6 0.975,-2.918; 7 1.625,-2.918; 8 2.275,-2.918; 9 2.275,2.918; 10 1.625,2.918; 11 0.975,2.918; 12 0.325,2.918; 13 -0.325,2.918; 14 -0.975,2.918; 15 -1.625,2.918; 16 -2.275,2.918
QFN40 = smd 0.85 x 0.28: 1 -3,2.25; 2 -3,1.75; 3 -3,1.25; 4 -3,0.75; 5 -3,0.25; 6 -3,-0.25; 7 -3,-0.75; 8 -3,-1.25; 9 -3,-1.75; 10 -3,-2.25; 21 3,-2.25; 22 3,-1.75; 23 3,-1.25; 24 3,-0.75; 25 3,-0.25; 26 3,0.25; 27 3,0.75; 28 3,1.25; 29 3,1.75; 30 3,2.25 | smd 0.28 x 0.85: 11 -2.25,-3; 12 -1.75,-3; 13 -1.25,-3; 14 -0.75,-3; 15 -0.25,-3; 16 0.25,-3; 17 0.75,-3; 18 1.25,-3; 19 1.75,-3; 20 2.25,-3; 31 2.25,3; 32 1.75,3; 33 1.25,3; 34 0.75,3; 35 0.25,3; 36 -0.25,3; 37 -0.75,3; 38 -1.25,3; 39 -1.75,3; 40 -2.25,3 | smd 2.7 x 3.5: P$2 0,0 | smd 1 x 1.5: P$11 -0.65,0.9; P$12 0.65,0.9; P$13 0.65,-0.9; THERMAL -0.65,-0.9 | drill 0.4 pad 0.406: VIA1 0,1; VIA2 -1,0; VIA3 0,0; VIA4 1,0; VIA5 0,-1
MICRO_USB = smd 0.4 x 1.4: 1_+5V -1.3,2.65; 2_D- -0.65,2.65; 3_D+ 0,2.65; 4_ID 0.65,2.65; 5_0V 1.3,2.65 | smd 4 x 1.9: GND1 0,0 | smd 1.35 x 1.9: GND2 -3.55,0; GND5 3.55,0 | smd 1.15 x 1.45: P$1 -2.4,2.25; P$7 2.4,2.25
53261-02 = smd 0.8 x 2: 1 0.625,-2.5; 2 -0.625,-2.5 | smd 2.1 x 3: S1 3.125,0.625; S2 -3.125,0.625
70543-03 = drill 1.016 long: 1 -2.54,0; 2 0,0; 3 2.54,0
FH12-50S-0.5SH = smd 1.3 x 0.3: 1 3.95,27.8; 2 3.95,27.3; 3 3.95,26.8; 4 3.95,26.3; 5 3.95,25.8; 6 3.95,25.3; 7 3.95,24.8; 8 3.95,24.3; 9 3.95,23.8; 10 3.95,23.3; 11 3.95,22.8; 12 3.95,22.3; 13 3.95,21.8; 14 3.95,21.3; 15 3.95,20.8; 16 3.95,20.3; 17 3.95,19.8; 18 3.95,19.3; 19 3.95,18.8; 20 3.95,18.3; 21 3.95,17.8; 22 3.95,17.3; 23 3.95,16.8; 24 3.95,16.3; 25 3.95,15.8; 26 3.95,15.3; 27 3.95,14.8; 28 3.95,14.3; 29 3.95,13.8; 30 3.95,13.3; 31 3.95,12.8; 32 3.95,12.3; 33 3.95,11.8; 34 3.95,11.3; 35 3.95,10.8; 36 3.95,10.3; 37 3.95,9.8; 38 3.95,9.3; 39 3.95,8.8; 40 3.95,8.3; 41 3.95,7.8; 42 3.95,7.3; 43 3.95,6.8; 44 3.95,6.3; 45 3.95,5.8; 46 3.95,5.3; 47 3.95,4.8; 48 3.95,4.3; 49 3.95,3.8; 50 3.95,3.3 | smd 2.4 x 2.4: P$1 0.7,1.2; P$2 0.7,29.9

### Placement (x,y rotation side)
0  72.16,33.63 0 top
1  5.43,33.63 0 top
2  12.86,33.63 0 top
3  20.27,33.63 0 top
4  27.68,33.63 0 top
5  35.2,33.63 0 top
6  42.51,33.63 0 top
7  49.97,33.63 0 top
8  57.33,33.63 0 top
9  64.73,33.63 0 top
!  64.73,11.71 0 top
(  72.16,18.55 0 top
)  79.56,18.55 0 top
+  79.56,25.39 0 top
,  72.16,11.71 0 top
-  79.56,33.63 0 top
.  79.56,11.71 0 top
?  57.33,11.71 0 top
@  64.73,4.87 0 top
A  5.43,18.55 0 top
B  35.2,11.71 0 top
C  20.27,11.71 0 top
C1  67.91,48 270 bottom
C2  37.9,63.2 0 bottom
C3  37.9,58.3 180 bottom
C4  37.9,61.5 180 bottom
C5  54.45,52 180 bottom
C6  26.95,80.15 0 bottom
C7  27.15,63 0 bottom
C9  45.35,50.25 270 bottom
C10  70.25,82.8 180 bottom
C11  62.9,85.55 270 bottom
C12  70.25,84.4 0 bottom
C13  39.2,85.95 0 bottom
C14  42.9,85.95 180 bottom
C15  77.75,78.5 180 bottom
C16  70.25,87.5 0 bottom
C17  70.25,86 0 bottom
C18  37.9,59.9 180 bottom
C19  31.15,77.4 0 bottom
C20  31.15,83 0 bottom
C21  27,77.8 0 bottom
C22  28.8,67.45 0 bottom
C23  23.5,66.1 180 bottom
D  20.27,18.55 0 top
D1  25.85,86 0 bottom
D4  29.75,71.85 0 bottom
D5  64.5,90 0 bottom
E  20.27,25.39 0 top
F  27.68,18.55 0 top
FN-RIGHT  75.86,4.87 0 top
G  35.2,18.55 0 top
H  42.51,18.55 0 top
I  57.33,25.39 0 top
IC1  42.25,91.4 0 bottom
IC2  61.7,49.7 270 bottom
J  49.97,18.55 0 top
K  57.33,18.55 0 top
L  64.73,18.55 0 top
L1  23.05,81.4 90 bottom
L2  67.15,84.8 90 bottom
LED1  67.4,94.7 180 bottom
M  49.97,11.71 0 top
N  42.51,11.71 0 top
O  64.73,25.39 0 top
P  72.16,25.39 0 top
Q  5.43,25.39 0 top
Q1  37.85,50.25 0 bottom
Q3  76.97,53.9 270 bottom
R  27.68,25.39 0 top
R1  69,51.2 0 bottom
R2  28.1,61.1 0 bottom
R3  72.1,49.6 180 bottom
R4  55.5,49.1 90 bottom
R5  53.5,49.1 90 bottom
R6  28.1,59 0 bottom
R7  82,39.1 180 top
R8  81.75,80.95 180 bottom
R9  81.7,87.3 0 bottom
R10  77.85,88.55 270 bottom
R11  31.7,89.65 90 bottom
R12  68.15,92.25 90 bottom
R13  37.3,79.5 0 bottom
R14  37.3,77.5 0 bottom
R15  37.3,75.5 0 bottom
R16  37.3,73.5 180 bottom
R17  37.3,71.5 180 bottom
R18  24.55,50.25 90 bottom
R19  26.55,50.25 90 bottom
R20  28.55,50.25 90 bottom
R21  30.55,50.25 90 bottom
R22  32.55,50.25 90 bottom
R23  34.55,50.25 90 bottom
R24  41.05,50.25 270 bottom
R25  43.35,50.25 270 bottom
R26  81.75,78.85 180 bottom
R27  81.75,83.05 0 bottom
R28  81.75,85.15 0 bottom
R36  31.15,85.2 180 bottom
R37  30.05,80.4 90 bottom
R38  28.9,74.65 0 bottom
R39  60.15,92.6 0 bottom
R40  56.25,89.7 90 bottom
S  12.86,18.55 0 top
SHIFT-RIGHT  53.62,4.87 0 top
SHILFT-LEFT  9.14,4.87 0 top
SJ2  78.7,47 135 bottom
SPACE1  21.5,4.87 0 top
SPACE2  31.39,4.87 0 top
SPACE3  41.27,4.87 0 top
SV1  52.4,43.3 0 bottom
T  35.2,25.39 0 top
T1  59.55,89.8 90 bottom
TP1  70.5,62.15 270 bottom
TP2  67.7,62.15 0 bottom
U  49.97,25.39 0 top
U$1  75.75,82.6 270 bottom
U$2  26.95,82.7 270 bottom
U$3  24.6,74.2 270 bottom
U$4  77.3,68 90 bottom
U$5  69.6,55.95 180 bottom
U$6  32.7,60.6 180 bottom
U$7  75.6,29.65 45 bottom
U$9  74,94.7 180 bottom
U$10  24.55,69.4 180 bottom
V  27.68,11.71 0 top
W  12.86,25.39 0 top
X  12.86,11.71 0 top
X1  70.45,77.15 225 bottom
X3  82.65,50.5 270 bottom
X5  48,52.2 0 bottom
Y  42.51,25.39 0 top
Z  5.43,11.71 0 top

### Tracks (layer width: path | path; a pad name or v marks a point on that pad's centre or on a via)
+3V3  (via drill 0.5)
  Top 0.61: v59,94.4 60.4,93 73.7,93 v76.2,90.55 | v39.6,80.8 v40.45,81.65 42.2,83.4 v42.2,90.2 v42.2,91.45 | v75.5,79.5 80.15,79.5 82.65,82 82.65,85.95 v79.9,88.7
  Bottom 0.254: 39.45,63 38.85,63 C2.1 | 39.45,63 X5.35 | X5.37 40.45,62 39.45,63 | 36.23,65.62 36.2,65.6 31.7,65.6 30.43,64.33 U$6.1 28.42,63.52 C7.1 27.25,62.35 R2.2 | U$1.16 75.5,79.65 76,79.65 U$1.15 76,79.5 v75.5,79.5
  Bottom 0.305: 41.9,79 X5.3 39.9,79 | 41.9,78.5 X5.4 40.4,78.5 | 41.9,78 X5.5 40.9,78 | 41.9,77.5 X5.6 41.4,77.5 | X5.2 39.55,79.5 39.5,79.55 | X5.8 42.4,76.5 41.9,77 X5.7 | R6.2 27.25,56.7 29,55.05 36.6,55.05 37.15,55.65 37.55,56.05 37.55,57.9 C3.1
  Bottom 0.406: 27.2,61.05 R2.2 R6.2 | 36.23,65.62 C2.1 | 82.55,85.2 R28.1
  Bottom 0.61: 36.23,65.62 34.8,67.1 34.8,74.8 35.5,75.5 R15.2 R14.2 R13.2 36.45,80.25 37,80.8 38.9,80.8 39.2,80.5 | 41.9,77 41.4,77.5 40.9,78 40.4,78.5 39.9,79 39.5,79.4 39.5,79.55 39.5,80.2 39.2,80.5 | v59,94.4 59,93.05 R39.2 59.1,92.3 43.05,92.3 v42.2,91.45 v42.2,90.2 | 82.55,85.2 R9.1 81.15,88.7 v79.9,88.7 79.2,89.4 R10.1 77.3,89.4 v76.2,90.55 | v42.2,90.2 42.17,89.17 | 39.2,80.5 39.35,80.55 v40.45,81.65 | IC1.2 42.23,89.17 v42.2,90.2
  Bottom 0.813: C14.1 42.15,88.18 IC1.2
+5V  (via drill 0.5)
  Top 0.254: 75.25,45.45 75.24,42.04 SV1.4
  Top 0.813: 36.1,88.3 36.2,88.3 v36.7,88.3
  Top 1.016: v38.1,88.3 36.2,88.3 33.1,88.3 v23.05,78.25 v23.05,77.15 23.05,65 28.6,59.45 44.95,59.45 v46.05,58.35 | v46.05,56.95 v46.05,58.35 | v57.95,84.45 67.05,84.45 72.25,79.25 72.25,53.25 75.25,50.25 75.25,45.45 | SV1.4 SV1.2 | 45.85,58.55 v46.05,58.35
  Bottom 0.254: SJ2.2 SJ2.1
  Bottom 0.305: X5.43 45.25,59 | 60.45,84.45 60.75,84.45 60.9,84.6 60.55,84.6 v60.4,84.45
  Bottom 0.406: C6.1 27.7,79.4 27.35,79.05 25.85,79.05 25.05,78.25 25.05,76.4 24.55,75.9 24.55,74.5 U$3.4 U$10.4 28.05,68.35 C22.2 | X3.3 79.47,47.96 arc90 SJ2.2 | R12.1 68.15,88.25 67.15,87.25 L2.2 | SJ2.1 78.16,43.66 SV1.2
  Bottom 0.61: C6.1 28.25,80.7 U$2.3 27.4,81.75 26.45,82.7 24.75,82.7 24.35,82.3 24.35,81.2 L1.1 | C11.1 65.15,86.3 | C9.1 45.35,54.85 46.05,55.55 v46.05,56.95 v46.05,58.35 45.25,59
  Bottom 0.813: 65.15,86.3 L2.2 | IC1.3 39.94,86.16 | 39.94,86.16 C13.1 39.95,88.3 | v23.05,77.15 v23.05,78.25 L1.1 | 39.94,86.16 39.94,85.36 40.85,84.45 v57.95,84.45 | 60.45,84.45 60.65,84.45 62.5,86.3 C11.1
  Bottom 1.016: 39.95,88.3 v36.7,88.3 | v57.95,84.45 v60.4,84.45 60.45,84.45
  pour Top: 73.7,41.3 76.85,41.3 77.35,41.8 77.4,42.2 76.95,42.65 76.6,42.85 76.55,44.6 75.8,45.5 74.75,45.5 73.95,44.65 73.95,43.05 73.25,42.35 73.25,41.75
+15V
  Bottom 0.61: R36.2 32,83.1 C20.1 C19.1 31.9,72.15 D4.C | D1.C 28.9,87.15 28.9,88.6 29.65,89.35 31.05,89.35 31.7,88.7 31.7,85.5 R36.2 | 32.05,85.2 R36.2
BASE
  Bottom 0.61: T1.1 R40.1
CE0
  Bottom 0.305: X5.38 45.9,61.5 50,57.4 50,51.1 47.3,48.4 47.3,43.32 SV1.24
COL0  (via drill 0.5)
  Top 0.254: 1.IN 5.73,33.63 v5.75,33.65 | v13.1,33.65 12.84,33.65 2.IN | 3.IN 20.02,33.63 v20,33.65 | 4.IN 27.42,33.63 v27.4,33.65 | 5.IN 34.97,33.63 v34.95,33.65 | 6.IN 42.27,33.63 v42.25,33.65 | 7.IN 49.67,33.63 v49.65,33.65 | 8.IN 57.18,33.63 v57.15,33.6 | 9.IN 64.52,33.63 v64.5,33.65 | 0.IN 71.92,33.63 v71.7,33.65 | -.IN 80.27,33.63 v79.7,34.05
  Bottom 0.254: v5.75,33.65 v13.1,33.65 v20,33.65 20.02,33.63 3.IN 20.29,33.65 v27.4,33.65 27.42,33.63 4.IN 27.7,33.65 v34.95,33.65 v42.25,33.65 42.27,33.63 6.IN 42.52,33.65 v49.65,33.65 49.7,33.6 v57.15,33.6 57.18,33.63 8.IN 57.34,33.65 v64.5,33.65 64.52,33.63 9.IN 64.75,33.65 v71.7,33.65 72.2,33.65 76,37.45 78.6,37.45 79.7,36.35 v79.7,34.05 77.5,36 76,36 74.25,34.2 74.25,33.48 U$7.29
COL1  (via drill 0.5)
  Top 0.254: Q.IN 5.6,25.39 v5.3,25 | v12.9,25 W.IN | E.IN 20.3,24.99 20.3,25.05 | 27.55,25.39 R.IN 27.7,25.02 v27.7,25 | 27.55,25.39 v27.7,25 | T.IN 35.05,25.39 v35.15,25 | Y.IN 42.35,25.39 v42.35,25 | U.IN 49.8,25.39 v49.95,25 | I.IN 57.16,25.39 v57.35,25 | O.IN 64.59,25.39 v64.7,25 | P.IN 72.01,25.39 v72.15,25 | +.IN 80.3,25.39 v79.8,24.95 | v76.8,21.45 76.8,26.65 78.25,28.1 78.25,31 76.85,32.45 76.85,34.9 v77,35.2 | 20.1,25 v20.25,25 | v20.25,25 20.3,25.05 | 20.3,25.05 20.35,25 v20.25,25 | 27.55,25.39 27.6,25.34 27.6,25 v27.7,25
  Bottom 0.254: v5.3,25 v12.9,25 | v12.9,25 W.IN | v27.7,25 v35.15,25 35.05,25.39 T.IN 35.2,25 v42.35,25 v42.35,24.99 42.51,24.99 42.66,25 v49.95,25 49.94,25.04 50.06,25.04 50.17,25 v57.35,25 v64.7,25 | v27.7,25 v12.9,25 | v64.7,25 64.79,24.94 64.78,24.99 65.19,25 v72.15,25 | U$7.30 75.12,33.32 v77,35.2 | v79.8,24.95 76.8,22.3 v76.8,21.45 76.05,20.55 66.55,20.55 64.7,22.4 v64.7,25 | v20.25,25 v27.7,25
COL2  (via drill 0.5)
  Top 0.254: SHILFT-LEFT.IN 9.28,4.87 arc-90 v9.15,4.85 | v21.5,4.85 21.52,4.85 SPACE1.IN | SPACE2.IN 31.27,4.87 v31.45,4.85 | SPACE3.IN 41.23,4.87 v41.2,4.9 | SHIFT-RIGHT.IN 53.57,4.87 v53.55,4.85 | @.IN 64.67,4.87 v64.65,4.85 | FN-RIGHT.IN 75.72,4.87 v75.7,4.85
  Bottom 0.254: v9.15,4.85 v21.5,4.85 v31.45,4.85 31.43,4.87 SPACE2.IN 31.41,4.9 v41.2,4.9 41.25,4.85 v53.55,4.85 v64.65,4.85 v75.7,4.85 75.72,4.87 FN-RIGHT.IN 82.65,11.66 82.65,29.9 79.8,32.75 79.1,32.75 77.85,34 76.77,34 U$7.31
COL3  (via drill 0.5)
  Top 0.254: Z.IN 5.25,11.7 v5.45,11.7 | v12.85,11.7 13.49,11.71 X.IN | C.IN 20.25,11.7 v20.2,11.7 | V.IN 27.66,11.7 v27.6,11.7 | B.IN 35.19,11.7 v35.05,11.7 | N.IN 42.49,11.7 v42.3,11.7 | M.IN 49.95,11.7 v49.7,11.7 | ?.IN v57.2,11.71 v57.2,11.7 | !.IN v64.55,11.71 v64.55,11.7 | ,.IN v72,11.71 v72,11.7 | ..IN v79.4,11.71 v79.4,11.7
  Bottom 0.254: v5.45,11.7 v12.85,11.7 v20.2,11.7 20.25,11.7 C.IN v27.59,11.71 v27.6,11.7 27.66,11.7 V.IN v35.04,11.71 v35.05,11.7 v42.3,11.7 42.49,11.7 N.IN 49.15,11.71 | v49.7,11.7 v49.69,11.71 49.15,11.71 | 49.15,11.71 49.15,11.7 v57.2,11.7 v64.55,11.7 v72,11.7 v79.4,11.7 v79.41,11.71 ..IN 82.2,14.35 82.2,29.75 79.65,32.3 78.9,32.3 77.65,33.55 77.03,33.55 U$7.32
COL4  (via drill 0.5)
  Top 0.254: ).IN v79.4,18.55 | v72.05,18.55 (.IN | L.IN v64.85,18.55 | K.IN v57.2,18.55 | J.IN v50.1,18.55 | H.IN v42.65,18.55 | G.IN v35.35,18.55 | F.IN v27.8,18.55 | D.IN v20.45,18.55 | S.IN v13.05,18.55 | A.IN v5.65,18.55
  Bottom 0.254: v5.65,18.55 v13.05,18.55 v20.45,18.55 v27.8,18.55 v35.35,18.55 v42.65,18.55 v50.1,18.55 v57.2,18.55 v64.85,18.55 v72.05,18.55 v79.4,18.55 79.65,18.55 81.7,20.6 81.7,29.65 79.5,31.85 78.75,31.85 77.5,33.1 77.28,33.1 U$7.33
COLLECTOR
  Bottom 0.61: T1.3 60.75,90 D5.K
D+
  Bottom 0.305: U$9.3_D+ 74,90.6 74.35,90.25 74.35,85.8 75,85.15 U$1.2
D-  (via drill 0.5)
  Top 0.305: v75.5,89.1 v73.35,89.1
  Bottom 0.305: U$1.3 v75.5,89.1 | v73.35,89.1 U$9.2_D-
DE
  Bottom 0.305: R17.2 40.65,74 X5.13
DISPLAY_RESET
  Bottom 0.254: SV1.33 32.86,47.6 | X5.9 45.2,76 46.6,77.4 46.6,79.6 43.25,82.95 36.75,82.95 33.4,79.6 33.4,69.15 29.9,65.65 25.95,65.65 23.25,62.95 23.25,60
  Bottom 0.305: R13.1 41.65,76 X5.9 | 32.86,47.6 32.26,48.2 23.7,48.2 23.25,48.65 23.25,60
FB
  Bottom 0.61: U$2.2 30.1,82.7 C20.2 | R37.2 30.05,82.65 C20.2 | C20.2 30.4,85.1 R36.1 R11.3
GND  (via drill 0.5)
  Bottom 0.254: U$1.18 74.5,79.75 75,79.75 U$1.17 | U$7.4 77.37,28.94 | U$7.1 78.48,29.95 | U$7.THERMAL 75.42,28.57 76.8,29.95 76.96,29.95 U$7.37
  Bottom 0.305: 44.1,73.5 X5.14 | X5.14 41.8,73.5 41.8,73 | 41.8,73 41.8,72.5 | 41.8,72.5 41.8,72 | 41.8,72 41.8,71.5 | 41.8,71.5 41.8,71 | 41.8,71 41.8,70.5 | 41.8,70.5 41.8,70 | 41.8,70 41.8,69.5 | 41.8,69.5 41.8,69 | 41.8,69 41.8,68.5 | 41.8,67.5 41.8,67 | 41.8,67 41.8,66.5 | 41.8,66.5 41.8,66 | 41.8,66 41.8,65.5 | 41.8,65.5 41.8,65 | 41.8,65 41.8,64.5 X5.32 | 41.8,65 X5.31 46.1,65 | 41.8,65.5 X5.30 46.1,65.5 | 41.8,66 X5.29 46.1,66 | 41.8,66.5 X5.28 46.1,66.5 | 41.8,67 X5.27 46.1,67 | 41.8,67.5 X5.26 46.1,67.5 | 41.8,68.5 X5.24 46.1,68.5 | 41.8,68.5 41.8,68 | 41.8,68 X5.25 46.1,68 | 41.8,68 41.8,67.5 | 41.8,69 X5.23 46.1,69 | 41.8,69.5 X5.22 46.1,69.5 | 41.8,70 X5.21 46.1,70 | 41.8,70.5 X5.20 46.1,70.5 | 41.8,71 X5.19 46.1,71 | 41.8,71.5 X5.18 46.1,71.5 | 41.8,72 X5.17 46.1,72 | 41.8,73 X5.15 46.1,73 | 41.8,72.5 X5.16 46.1,72.5 | X5.14 46.1,73.5 46.1,73 | 46.1,73 46.1,72.5 | 46.1,72.5 46.1,72 | 46.1,72 46.1,71.5 | 46.1,71.5 46.1,71 | 46.1,71 46.1,70.5 | 46.1,70.5 46.1,70 | 46.1,70 46.1,69.5 | 46.1,69.5 46.1,69 | 46.1,69 46.1,68.5 | 46.1,68.5 46.1,68 | 46.1,68 46.1,67.5 | 46.1,67.5 46.1,67 | 46.1,67 46.1,66.5 | 46.1,66.5 46.1,66 | 46.1,66 46.1,65.5 | 46.1,65.5 46.1,65 | 46.1,65 46.1,64.5 44.6,64.5 | U$1.P$1 75,81.85 U$1.17 | 77.37,28.94 77.31,28.94 76.31,29.94 U$7.VIA1
  Bottom 0.406: 23.1,67.15 U$10.2 | R26.2 R8.2 R27.1
  other vias: 61.7,49.75 36,61.5 33.7,61.15 35.95,63.6 21.4,47.1 67.8,55.95 45.6,78.55 28.9,56.5
  pour Bottom: 0,39 0,3 arc90 3,0 82,0 arc90 85,3 85,92.6 arc90 81.6,96 21.36,95.9 arc90 20.5,95.04 20.5,40 1,40 arc90
  pour Top (rank 2): 0,39 0,3 arc90 3,0 82,0 arc90 85,3 85,92.6 arc90 81.6,96 21.5,96 arc90 20.5,95 20.5,40 1,40 arc90
H_SYNC
  Bottom 0.305: X5.11 38.65,75 R15.1
ID_SC
  Bottom 0.254: IC2.6 58.38,49.05 59.6,49.05 60,48.65 60,41.35 58.4,39.75 45,39.75 43.51,41.24 SV1.28
  Bottom 0.305: R4.1 56.31,49.06 IC2.6
ID_SD
  Bottom 0.254: SV1.27 43.93,44.57 44.75,43.75 44.75,40.8 45.3,40.25 56.95,40.25 57.5,40.8 57.5,47.8 | R5.1 54.4,47.35 56.2,47.35 56.65,47.8 57.5,47.8 | 57.5,47.8 IC2.5
IN_1
  Bottom 0.61: U$3.1 25.95,77.5 C21.2
INT  (via drill 0.5)
  Top 0.254: 31.15,55 30.7,55.45 30.7,56.85 31.65,57.8 35.15,57.8 35.65,57.3 v36.2,56.7 38.8,54.1 46.9,54.1 49.45,56.65 49.45,78.5 56.8,85.85 70.05,85.85 72.85,83.05 79.3,83.05 80.8,84.55 80.8,85.45 v80.05,86.2 | v67.85,37.05 68,36.9 v68,23.65
  Top 0.305: 31.15,55 36.1,50.05 63.43,50.05 SV1.7
  Bottom 0.254: U$1.7 78.9,83.85 80,84.95 80,86.15 v80.05,86.2 | U$7.12 73.65,25.23 73.65,24.6 72.7,23.65 v68,23.65 | v67.85,37.05 67.6,37.3 67.6,43.26 SV1.7
  Bottom 0.305: U$5.7 68.97,44.62 SV1.7 | U$6.10 34.33,57.02 34.65,56.7 v36.2,56.7
IR_RX
  Top 0.254: X3.1 79.14,53.04 77.75,51.65 77.75,49.7 79.15,48.3 79.15,42.05 77,39.9 35.48,39.9 SV1.36
IR_TX  (via drill 0.5)
  Top 0.406: SV1.38 29.6,43.24 29.6,46 21.55,54.05 21.55,83.3 31.5,93.25 44.5,93.25 v47,90.75
  Bottom 0.406: R40.2 56.05,90.75 v47,90.75
LEDK1
  Bottom 0.254: X5.44 40.45,58.5 36.9,54.55 28.4,54.55 R18.2
  Bottom 0.305: 24.8,51.1 R18.2
LEDK2
  Bottom 0.254: X5.45 41.25,58 37.15,54.05 29.9,54.05 R19.2
LEDK3
  Bottom 0.254: X5.46 41.45,57.5 37.4,53.55 31.35,53.55 R20.2
LEDK4
  Bottom 0.254: X5.47 41.7,57 37.6,53.05 32.75,53.05 R21.2
LEDK5
  Bottom 0.254: X5.48 41.9,56.5 37.8,52.6 34.15,52.6 R22.2
LEDK6
  Bottom 0.254: R23.2 35.55,52.15 38,52.15 42.1,56 X5.49
LX
  Bottom 0.61: L1.2 23.95,83.8 | 23.95,83.8 D1.A | U$2.5 24.1,83.65 23.95,83.8
MISO
  Bottom 0.305: X5.33 45.8,64 51.8,58 51.8,47.3 53.2,45.9 54.6,45.9 55,45.5 55,43.7 54.6,43.3 52.4,43.3 SV1.21
MOSI
  Bottom 0.305: X5.34 45.5,63.5 51.2,57.8 51.2,47.04 SV1.19
N$1
  Bottom 0.305: U$1.19 72.9,81.35 72.8,81.45 | U$1.20 72.4,81.85 72.5,81.75
  Bottom 0.61: L2.1 67.35,82.8 C10.1 69.5,82.45 70.1,81.75 72.5,81.75 72.8,81.45
N$2
  Bottom 0.254: U$1.21 71.45,82.35 C10.2
N$3
  Bottom 0.254: U$1.14 76.5,78.9 C15.1 U$1.13
  Bottom 0.813: C15.1 72.66,78.5 X1.1 68.3,74.12 68.3,66.65 70.5,64.45 TP1.TP
N$4
  Bottom 0.61: LED1.A R12.2
N$5
  Bottom 0.254: U$1.22 72.55,82.85 C12.1
N$6  (via drill 0.5)
  Top 0.254: R7.1 84.05,39.93 84.05,44.85 82.65,46.25 81,46.25 80.25,47 80.25,49.2 v80,49.45
  Bottom 0.254: U$1.11 78.3,81.85 80,80.15 80,79.65 80.8,78.85 R26.1 80.9,77.95 83.7,75.15 83.7,57.65
  Bottom 0.305: 83.7,57.65 80.4,54.35 80.4,49.85 v80,49.45
N$7
  Bottom 0.254: U$1.10 79.5,82.35 R8.1
N$8
  Bottom 0.254: U$1.23 72.7,83.35 71.75,84.3 71.75,85.25 C17.1
N$9  (via drill 0.5)
  Top 0.254: v65.4,94.7 75.05,94.7 78.05,91.7 78.05,89.45 v76.45,87.85
  Bottom 0.254: U$1.4 76,87.4 v76.45,87.85 | v65.4,94.7 LED1.C
N$11
  Bottom 0.254: U$5.1 67.69,57.76 69.25,56.2 73.5,56.2 74.1,55.6 77.2,55.6 78.29,56.69 Q3.1
N$12
  Bottom 0.61: R18.1 R19.1 R20.1 R21.1 R22.1 R23.1 34.55,49.3 Q1.2
N$13
  Bottom 0.254: U$5.2 68.97,57.53 69.81,56.69 Q3.4
N$15
  Bottom 0.254: U$1.9 80.7,82.85 R27.2
N$16
  Bottom 0.61: C21.1 28,77.55 R38.2 D4.A
N$17
  Bottom 0.254: U$1.8 79.1,83.35 R28.2
N$20
  Bottom 0.61: Q1.1 40.55,51 R24.1
N$30
  Bottom 0.406: D5.A 65.8,90.03 65.8,91.55 64.75,92.6 R39.1
OUT1_IN2
  Bottom 0.406: U$3.3 23.45,72.8 U$10.1
OUT2
  Bottom 0.254: 25.6,68.05 25.6,67.45 C23.2
  Bottom 0.305: U$10.3 25.6,68.05
P_CLK
  Bottom 0.305: R16.2 39.15,74.5 X5.12
PWM  (via drill 0.5)
  Top 0.305: v44.4,47.4 61,47.4 SV1.11
  Bottom 0.305: R25.2 43.35,48.45 v44.4,47.4
  Bottom 0.61: R24.2 R25.2
RANDOM
  Bottom 0.305: C23.1 22.65,65.45 22.65,48.45 23.45,47.65 32.1,47.65 34.6,45.15 34.6,43.85 35.25,43.2 37.26,43.2 SV1.32
ROW0  (via drill 0.5)
  Top 0.254: SHILFT-LEFT.OUT 9.12,6.75 8.2,6.75 6.85,8.1 6.85,10.35 arc90 7.4,10.9 7.4,11.65 arc90 Z.OUT Z.OUT arc-90 5.4,13.64 5.4,16.4 arc-90 3.4,18.4 3.4,18.55 arc-90 5.3,20.45 A.OUT arc-90 5.4,20.48 5.4,23.35 arc-90 3.45,25.3 3.45,25.4 arc-90 5.34,27.29 Q.OUT arc90 5.45,27.3 5.45,31.65 | 1.OUT 1.OUT arc90 3.5,33.6 arc90 5.45,31.65 | v7.6,31.6 7.55,31.65 5.45,31.65
  Bottom 0.254: U$7.15 72.9,26.6 12.6,26.6 v7.6,31.6
ROW1  (via drill 0.5)
  Top 0.254: 2.OUT 12.73,35.53 arc90 10.85,33.65 10.85,33.55 arc90 12.85,31.55 | 12.85,31.55 W.OUT arc90 W.OUT 12.74,27.29 arc90 10.85,25.4 10.85,25.35 arc90 12.9,23.3 12.9,20.5 arc-90 S.OUT 12.75,20.45 arc90 10.85,18.55 10.85,18.45 arc90 12.85,16.45 X.OUT arc90 X.OUT | v14.85,31.45 14.75,31.55 12.85,31.55
  Bottom 0.254: U$7.16 72.65,27.05 19.25,27.05 v14.85,31.45
ROW2  (via drill 0.5)
  Top 0.254: SPACE1.OUT 20.25,8.02 20.25,9.65 arc90 22.2,11.6 22.2,11.75 arc90 20.34,13.61 C.OUT arc90 20.3,13.64 20.3,16.55 arc-90 18.3,18.55 arc-90 20.2,20.45 D.OUT arc-90 20.25,20.46 20.25,23.3 arc-90 18.25,25.3 18.25,25.4 arc-90 20.14,27.29 E.OUT arc-90 20.25,27.3 20.25,31.55 | 3.OUT 20.18,35.53 arc90 18.3,33.65 18.3,33.5 arc90 20.25,31.55 | v22.45,31.55 20.25,31.55
  Bottom 0.254: U$7.17 72.39,27.5 26.5,27.5 v22.45,31.55
ROW3  (via drill 0.5)
  Top 0.254: 4.OUT 27.53,35.53 arc90 25.65,33.65 arc90 27.7,31.6 27.7,31.35 | 27.7,31.35 27.7,27.32 arc-90 R.OUT 27.59,27.29 arc90 25.7,25.4 25.7,25.2 arc90 27.65,23.25 27.65,20.48 arc90 F.OUT 27.6,20.45 arc90 25.7,18.55 25.7,18.45 arc90 27.65,16.5 27.65,13.63 arc90 V.OUT 27.79,13.61 arc-90 29.7,11.7 29.7,11.05 arc-90 29,10.35 29,8.3 30.55,6.75 31.36,6.75 SPACE2.OUT | v29.85,31.6 27.95,31.6 27.7,31.35
  Bottom 0.254: U$7.18 72.13,27.95 33.5,27.95 v29.85,31.6
ROW4  (via drill 0.5)
  Top 0.254: B.OUT arc90 B.OUT 35.2,16.5 arc-90 33.25,18.45 33.25,18.55 arc-90 35.15,20.45 G.OUT arc90 G.OUT 35.2,23.35 arc-90 33.3,25.25 33.3,25.4 arc-90 T.OUT T.OUT arc90 T.OUT 35.2,31.5 | 5.OUT 35.03,35.53 arc90 33.15,33.65 33.15,33.55 arc90 35.2,31.5 | v37.3,31.65 35.35,31.65 35.2,31.5
  Bottom 0.254: U$7.19 71.88,28.4 40.55,28.4 v37.3,31.65
ROW5  (via drill 0.5)
  Top 0.254: 6.OUT 42.48,35.53 arc90 40.55,33.6 40.55,33.45 arc90 42.5,31.5 | 42.5,31.5 Y.OUT arc90 Y.OUT 42.49,27.29 arc90 40.6,25.4 40.6,25.3 arc90 42.5,23.4 H.OUT arc90 H.OUT 42.4,20.45 arc90 40.45,18.5 40.45,18.45 arc90 42.5,16.4 N.OUT arc90 N.OUT 42.41,13.61 arc90 40.5,11.7 40.5,11.2 arc90 41.75,9.95 41.27,9.46 SPACE3.OUT | v44.75,31.6 42.6,31.6 42.5,31.5
  Bottom 0.254: U$7.20 71.62,28.85 47.5,28.85 v44.75,31.6
ROW6  (via drill 0.5)
  Top 0.254: SHIFT-RIGHT.OUT 53.6,6.75 52.65,6.75 51.35,8.05 51.35,10.25 arc90 52,10.9 52,11.7 arc90 50.09,13.61 M.OUT arc-90 49.95,13.62 49.95,16.5 arc-90 47.9,18.55 47.9,18.6 arc-90 49.75,20.45 J.OUT arc-90 49.95,20.46 49.95,23.4 arc-90 48,25.35 48,25.4 arc-90 49.89,27.29 U.OUT arc90 50,27.32 50,31.5 | 7.OUT 49.93,35.53 arc90 48,33.6 48,33.5 arc90 50,31.5 | v52.3,31.95 50.45,31.95 50,31.5
  Bottom 0.254: U$7.21 71.12,30.95 53.3,30.95 v52.3,31.95
ROW7  (via drill 0.5)
  Top 0.254: 8.OUT 57.23,35.53 arc90 55.3,33.6 55.3,33.5 arc90 57.3,31.5 | 57.3,31.5 57.3,27.32 arc90 I.OUT 57.19,27.29 arc90 55.3,25.4 arc90 57.35,23.35 57.35,20.48 arc-90 K.OUT 57.3,20.45 arc90 55.4,18.55 55.4,18.35 arc90 57.3,16.45 57.3,13.63 arc90 ?.OUT | v59.7,32.1 58.4,32.1 57.8,31.5 57.3,31.5
  Bottom 0.254: U$7.22 71.33,31.45 60.35,31.45 v59.7,32.1
ROW8  (via drill 0.5)
  Top 0.254: @.OUT arc90 64.75,6.79 64.75,9.65 arc-90 62.7,11.7 arc-90 64.61,13.61 !.OUT arc-90 64.7,13.64 64.7,16.5 arc-90 62.75,18.45 62.75,18.55 arc-90 64.65,20.45 L.OUT arc90 64.75,20.46 64.75,23.25 arc-90 62.7,25.3 62.7,25.35 arc-90 64.64,27.29 O.OUT arc90 64.75,27.3 64.75,31.5 | 9.OUT 64.63,35.53 arc90 62.7,33.6 62.7,33.55 arc90 64.75,31.5 | v66.3,32.3 65.95,32.3 65.35,31.5 64.75,31.5
  Bottom 0.254: U$7.23 71.53,31.95 66.65,31.95 v66.3,32.3
ROW9  (via drill 0.5)
  Top 0.254: (.OUT 72.1,20.45 arc90 70.2,18.55 70.2,18.5 arc90 72.2,16.5 72.2,13.65 arc-90 ,.OUT 72.34,13.61 arc-90 74.2,11.75 74.2,11.05 arc-90 73.45,10.3 73.45,8.35 75,6.8 75.83,6.8 FN-RIGHT.OUT | (.OUT arc90 (.OUT | 0.OUT 71.88,35.53 arc90 70.1,33.75 | 70.1,33.75 arc90 72.2,31.65 72.2,27.34 arc-90 P.OUT 72.04,27.29 arc90 70.15,25.4 70.15,25.35 arc90 72.15,23.35 72.16,23.34 (.OUT | v70.35,32.75 70.5,33.2 70.15,33.2 70.1,33.25 70.1,33.75
  Bottom 0.254: U$7.24 71.44,32.75 v70.35,32.75
ROW10  (via drill 0.5)
  Top 0.254: 79.55,27.3 arc90 +.OUT | +.OUT 79.49,27.29 arc90 77.6,25.4 77.6,25.35 arc90 79.6,23.35 79.6,20.48 arc-90 ).OUT ).OUT arc90 77.65,18.55 77.65,18.5 arc90 79.55,16.6 79.55,13.62 arc90 ..OUT | v78.1,36.7 79.27,35.53 -.OUT 79.48,35.53 arc90 77.6,33.65 77.6,33.55 arc90 79.55,31.6 78.75,31.6 78.75,27.29 +.OUT
  Bottom 0.254: U$7.25 72.65,32.25 72.65,33.3 75.95,36.7 v78.1,36.7
SCK
  Bottom 0.305: X5.36 45.7,62.5 50.6,57.6 50.6,50.9 48.59,48.89 SV1.23
SCL_3V3  (via drill 0.5)
  Top 0.254: 29.1,63.1 v29.1,62.55 29.1,65.7 51.6,88.2 72.3,88.2 74.3,86.2 77.45,86.2 v77.85,86.6 | v69.7,22.45 69.7,23.2 68.5,24.4 68.5,35.25 v70.95,37.7
  Top 0.305: v32.1,55.95 36.75,51.25 64.77,51.25 SV1.5
  Bottom 0.254: U$6.12 33.02,59.02 31.8,60.25 30.4,60.25 29.15,59 R6.1 28.1,59.85 28.1,61.9 28.4,62.2 28.75,62.2 v29.1,62.55 | U$1.5 76.5,86.35 R10.2 v77.85,86.6 | U$7.11 74.1,24.97 74.1,24.4 72.9,23.2 70.45,23.2 v69.7,22.45 | v70.95,37.7 70.15,38.5 70.15,43.27 SV1.5
  Bottom 0.305: U$5.6 70.23,50.98 R1.1 69.85,46.17 SV1.5 | U$6.12 33.02,56.88 v32.1,55.95
SDA_3V3  (via drill 0.5)
  Top 0.254: v78.75,85.05 78.05,84.35 74.5,84.35 72,86.85 55.55,86.85 v30.65,61.95 | v80.75,28.3 v83.6,31.1
  Top 0.305: v34.3,55.95 37.9,52.4 66.16,52.4 SV1.3
  Bottom 0.254: R9.2 79.25,87.3 78.75,86.8 v78.75,85.05 78.3,84.6 U$1.6 | R3.1 71.25,47.31 SV1.3 72.75,43.33 72.7,37.75 73.35,37.1 74.95,37.1 75.8,37.9 78.85,37.9 83.6,33.15 v83.6,31.1 | U$6.11 33.67,59.08 31.65,61.1 30.65,61.1 | 30.65,61.1 R2.1 | v30.65,61.95 30.65,61.1 | U$7.10 76.67,25.4 78.45,25.4 80.75,27.75 v80.75,28.3
  Bottom 0.305: U$5.5 71.5,50.01 R3.1 | U$6.11 33.67,56.58 v34.3,55.95
STEPUP_ENABLE
  Bottom 0.254: 32.1,41.4 32.1,40.5 32.85,39.75 38.9,39.75 39.7,40.55 39.7,41.45
  Bottom 0.305: U$2.1 27.5,83.65 25.85,85.3 25.85,87 24.9,87.95 22.75,87.95 21.55,86.75 21.5,48.8 23.15,47.15 30.55,47.15 32.1,45.6 32.1,41.4 | 39.7,41.45 39.7,43.3 SV1.31
TOUCH_X+
  Bottom 0.254: X5.39 40.55,61 39.25,62.3 38.4,62.3 C2.2 37.15,63.85 35.9,65.1 32,65.1 31.07,64.17 U$6.2
TOUCH_X-
  Bottom 0.254: X5.41 39.05,60 C18.2 38.65,59.65 37.6,60.7 35.6,60.7 34.2,62.1 32.8,62.1 32.4,62.5 32.4,63.49 U$6.4
TOUCH_Y+
  Bottom 0.254: X5.42 40.2,59.5 40.13,59.42 39.8,59.1 38.65,59.1 | U$6.3 31.73,61.67 34.85,58.55 36,58.55 36.55,59.1 38.65,59.1 | C3.2 38.65,59.1
TOUCH_Y-
  Bottom 0.254: X5.40 39.5,60.5 C4.2 37.35,62.4 35.25,62.4 35.05,62.6 33.25,62.6 33.02,62.83 U$6.5
V_SYNC
  Bottom 0.305: X5.10 40.15,75.5 R14.1
VBAT+
  Bottom 0.254: 75.15,60.2 70.6,60.2 70.25,59.85 70.25,58.56 U$5.3
  Bottom 0.305: 75.15,60.2 U$4.+
VBUS
  Bottom 0.254: U$1.24 73.25,83.85 | U$1.1 74.4,84.55
  Bottom 0.406: C16.1 71.05,87.65 | U$9.1_+5V 72.7,91.1 72.35,90.75 | 72.55,84.55 72.55,84.85 | 74.4,84.55 72.55,84.55 | 73.25,83.85 72.55,84.55
  Bottom 0.813: 72.35,90.75 71,89.4 C16.1 | 71.05,87.65 72.55,86.15 72.55,84.85
VCC  (via drill 0.5)
  Top 0.254: v74.25,38.45 78.35,38.45 80,36.8 81.55,36.8 82.9,35.45 82.9,32.2 80.6,29.95 v80.35,29.95
  Bottom 0.254: R3.2 72.95,48.15 SV1.1 75.25,43.29 75.25,39.5 v74.25,38.45 | U$7.38 79.12,31.4 79.35,31.4 79.58,31.18 | 79.58,31.18 80.35,30.4 v80.35,29.95 | U$7.39 79.58,31.15 79.58,31.18
  Bottom 0.305: 73,49.7 R3.2 73,54.1 72.1,55 68.3,55 67.7,54.4 U$5.8 | C1.1 67.91,50.76 R1.2 | SV1.17 56.21,45.44 55,46.65 53.35,46.65 52.4,47.6 52.4,49.6 52.75,49.95 R5.2
  Bottom 0.61: C5.1 53.5,51.65 R5.2 R4.2 57.16,51.6 IC2.8 60.12,53.35 U$5.8 67.69,51.66 R1.2

### Text on the board
tPlace: CrackberryPi / v1.0.2
bPlace: CrackberryPi / v1.0.2
tNames: 20.5,0
bNames: ZLDO1117 / G33TA | SFH482 | 30R | LED | 30R | pot | uUSB-B | 10K | 1K | CM322522 / 8.2uH | 3x 4.7uF | BAT54W | BC847 | 4.7uF | CM322522 8.2uH | NCP1406 | 1.3M | BQ24297 | 4.7uF | 4.7uF | 68pF | 3x 10K | 110K | 317R | 47pF | 10mF | 10uF | 5x 10K | 10K | 470pF | 4.7uF | 30R | BAT-HLD-012 / CR1216 | BZT52B12 / 12V Zener | 2x MAX2650 | 0.1uF | 470pF | 609-1202-1-ND / ZIF-50 | 0.1uF | TSC2007 | 4x 0.1uF | 10K | + | 10K | MCP7940 | CM200C / 32.768kHz | 0.1uF | CAT24C32 | 6x 147R | IRLML5203 / MOSFET | 1uF | 10K | TSOP38238 | 45K | 10K | 10K | 2x 3.9K | 0.1uF | TCA8424